# EasyEDA Pro project TPS7A系列低噪声电源.eprj

# Schematic Schematic1
Board Name: Board1; Create Date: 2023-06-15; Page Name: P1; Project Name: TPS7A系列低噪声电源; Schematic Name: Schematic1; Update Date: 2025-04-09; Company: 嘉立创EDA; Page Size: A3; Version: V1.0
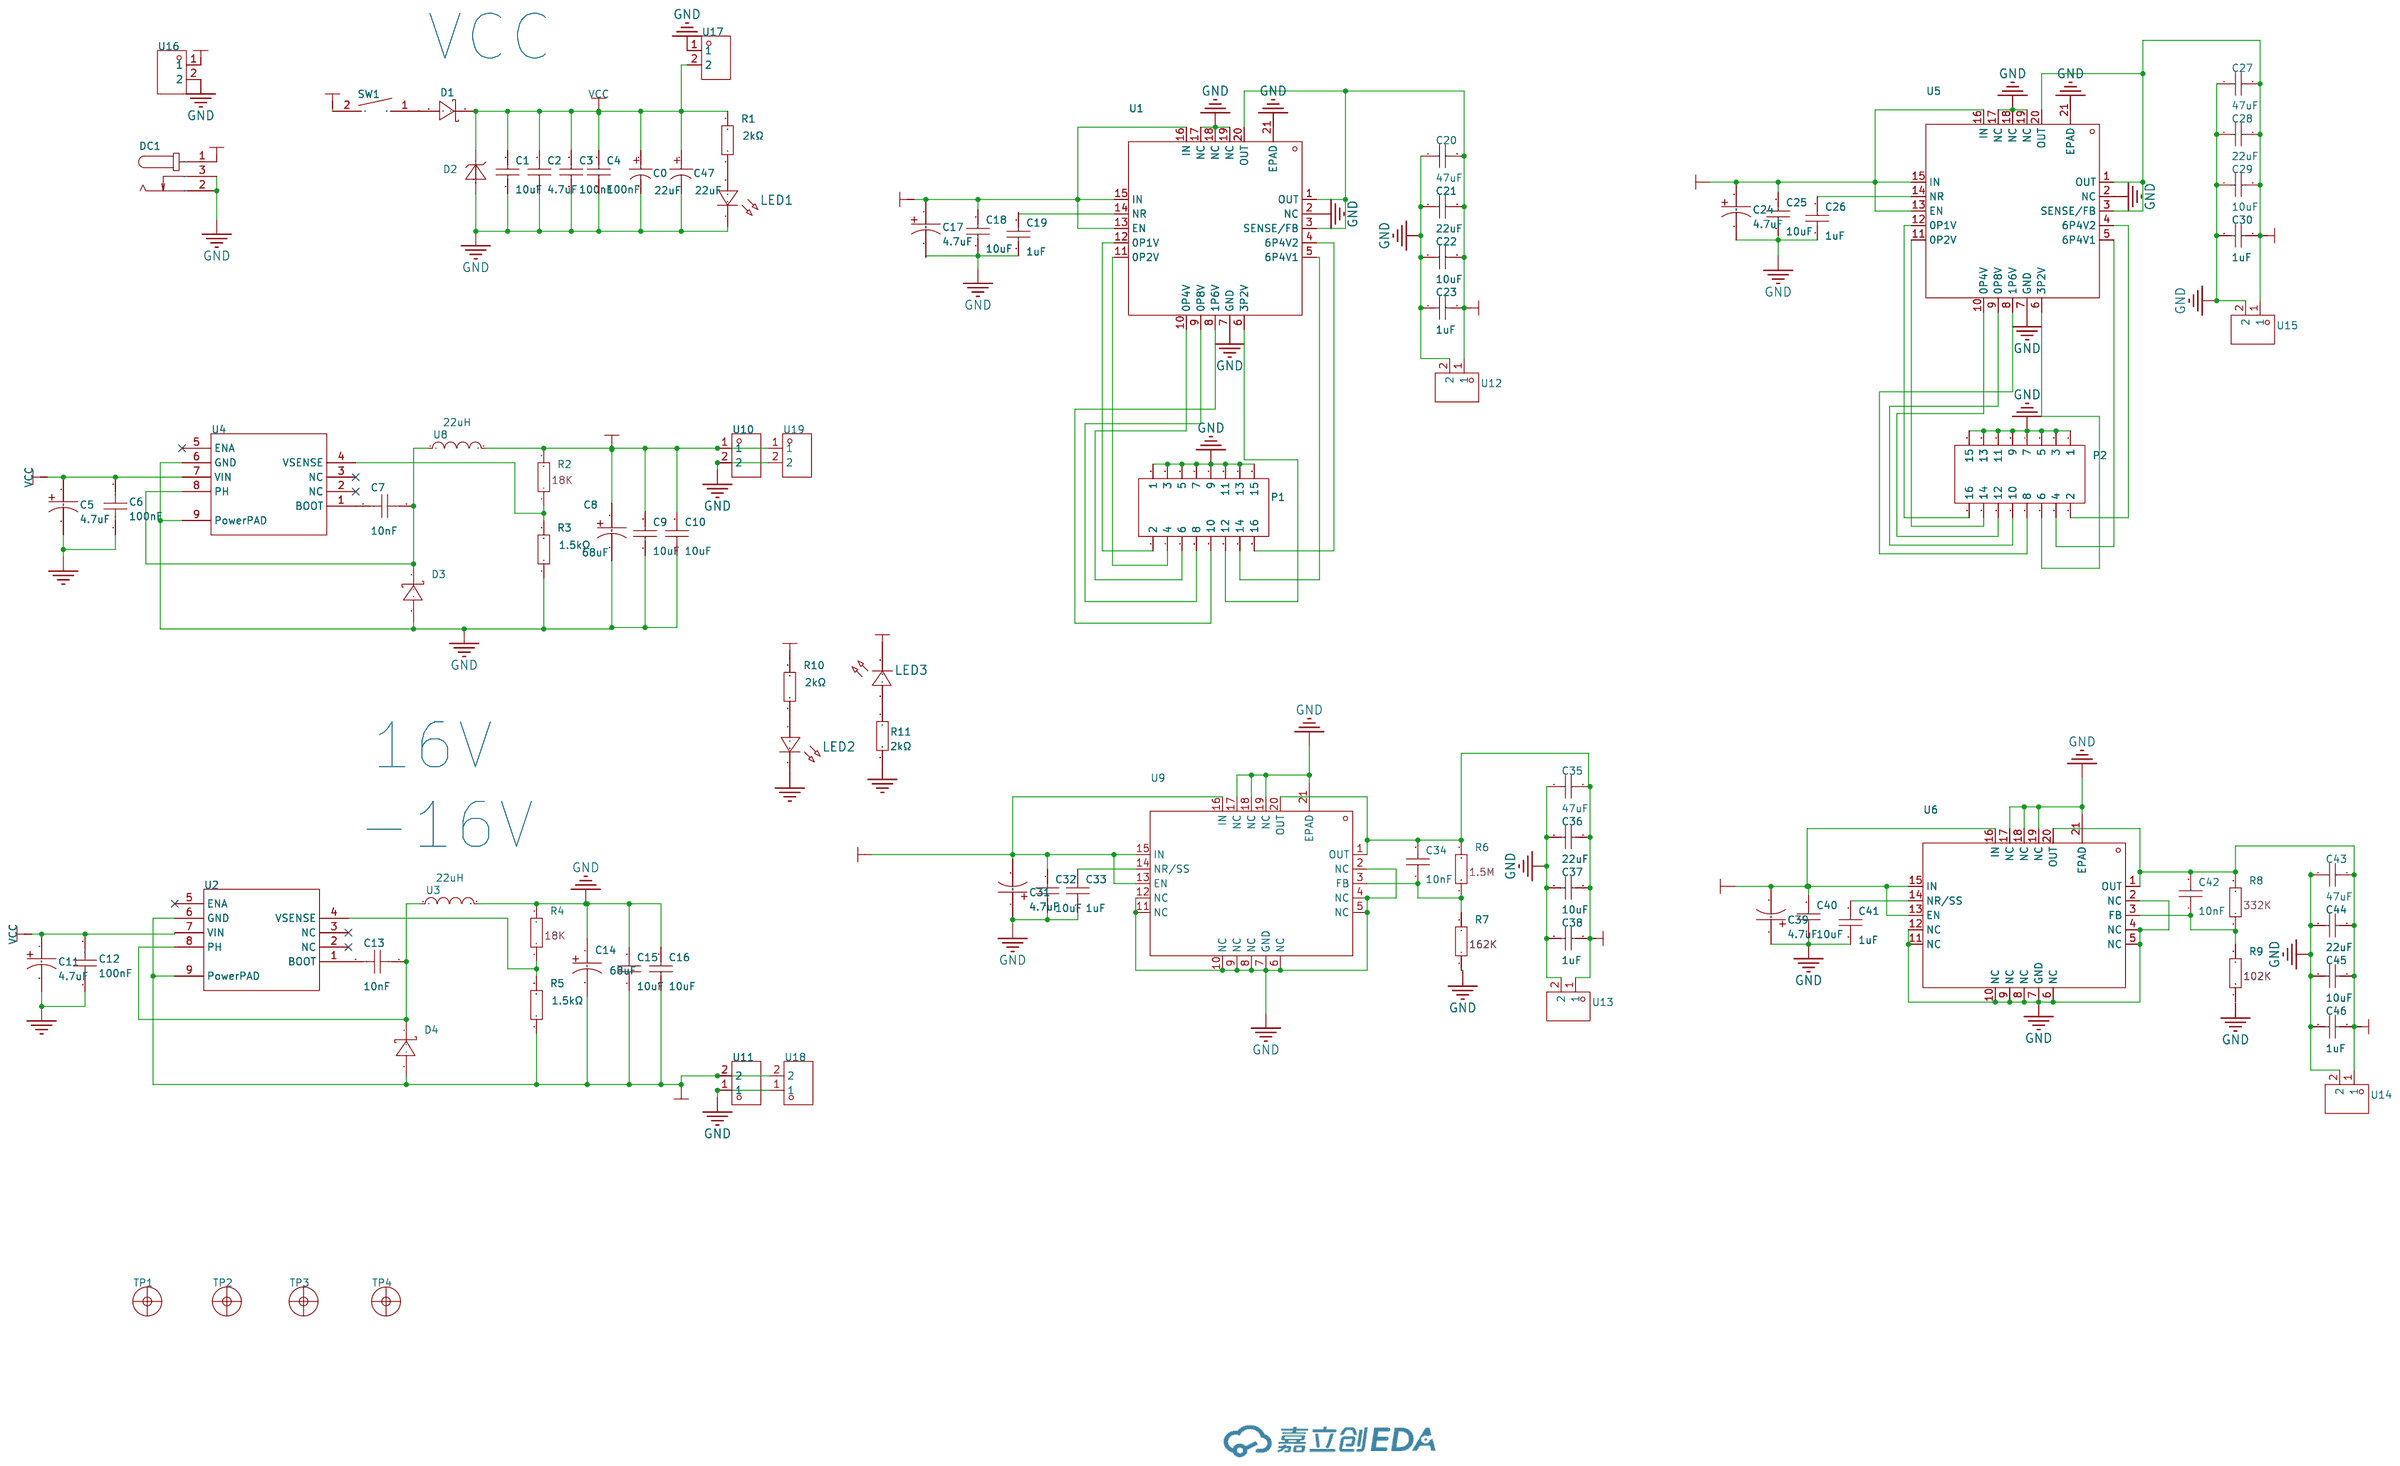
[diagram p0: schematic sheet]

## Parts
C0  22uF  [CAP-SMD_BD6.3-L6.6-W6.6-LS7.4-FD]
C1  10uF  [R0805]
C2  4.7uF  [R0805]
C3  100nF  [R0805]
C4  100nF  [R0805]
C5  4.7uF  [CAP-SMD_BD4.0-L4.3-W4.3-FD-A]
C6  100nF  [R0805]
C7  10nF  [R0805]
C8  68uF  [CAP-SMD_L7.3-W4.3]
C9  10uF  [R0805]
C10  10uF  [R0805]
C11  4.7uF  [CAP-SMD_BD4.0-L4.3-W4.3-FD-A]
C12  100nF  [R0805]
C13  10nF  [R0805]
C14  68uF  [CAP-SMD_L7.3-W4.3]
C15  10uF  [R0805]
C16  10uF  [R0805]
C17  4.7uF  [CAP-SMD_BD4.0-L4.3-W4.3-FD-A]
C18  10uF  [R0805]
C19  1uF  [R0805]
C20  47uF  [R0805]
C21  22uF  [R0805]
C22  10uF  [R0805]
C23  1uF  [R0805]
C24  4.7uF  [CAP-SMD_BD4.0-L4.3-W4.3-FD-A]
C25  10uF  [R0805]
C26  1uF  [R0805]
C27  47uF  [R0805]
C28  22uF  [R0805]
C29  10uF  [R0805]
C30  1uF  [R0805]
C31  4.7uF  [CAP-SMD_BD4.0-L4.3-W4.3-FD-A]
C32  10uF  [R0805]
C33  1uF  [R0805]
C34  10nF  [R0805]
C35  47uF  [R0805]
C36  22uF  [R0805]
C37  10uF  [R0805]
C38  1uF  [R0805]
C39  4.7uF  [CAP-SMD_BD4.0-L4.3-W4.3-FD-A]
C40  10uF  [R0805]
C41  1uF  [R0805]
C42  10nF  [R0805]
C43  47uF  [R0805]
C44  22uF  [R0805]
C45  10uF  [R0805]
C46  1uF  [R0805]
C47  22uF  [CAP-SMD_BD6.3-L6.6-W6.6-LS7.4-FD]
D1  B340A  [SMA_L4.3-W2.6-LS5.2-RD]
D2  SMBJ30A  [SMB_L4.4-W3.6-LS5.3-RD]
D3  B340A  [SMA_L4.3-W2.6-LS5.2-RD]
D4  B340A  [SMA_L4.3-W2.6-LS5.2-RD]
DC1  DC005  [DC-IN-TH_DC005]
LED1  -  [LED_0805]
LED2  -  [LED_0805]
LED3  -  [LED_0805]
P1  2.54-2*8P针  [HDR-TH_16P-P2.54-V-M-R2-C8-S2.54]
P2  2.54-2*8P针  [HDR-TH_16P-P2.54-V-M-R2-C8-S2.54]
R1  2kΩ  [R0805]
R2  0805W8F9101T5E  [R0805]
R3  1.5kΩ  [R0805]
R4  0805W8F9101T5E  [R0805]
R5  1.5kΩ  [R0805]
R6  0805W8F9101T5E  [R0805]
R7  0805W8F9101T5E  [R0805]
R8  0805W8F9101T5E  [R0805]
R9  0805W8F9101T5E  [R0805]
R10  2kΩ  [R0805]
R11  2kΩ  [R0805]
SW1  RS601HL-1010011BB  [SW-TH_RS601HL-1010011BB]
TP1  -  [M3]
TP2  -  [M3]
TP3  -  [M3]
TP4  -  [M3]
U1  TPS7A4701RGWR  [VQFN-20_L5.0-W5.0-P0.65-TL-EP]
U2  TPS5430DDAR  [SOIC-8_L5.0-W4.0-P1.27-LS6.0-BL-EP2.0]
U3  22uH  [IND-SMD_L7.0-W6.6]
U4  TPS5430DDAR  [SOIC-8_L5.0-W4.0-P1.27-LS6.0-BL-EP2.0]
U5  TPS7A4701RGWR  [VQFN-20_L5.0-W5.0-P0.65-TL-EP]
U6  TPS7A3301RGWR  [VQFN-20_L5.0-W5.0-P0.65-TL-EP]
U8  22uH  [IND-SMD_L7.0-W6.6]
U9  TPS7A3301RGWR  [VQFN-20_L5.0-W5.0-P0.65-TL-EP]
U10  KF301-5.0-2P  [CONN-TH_P5.00_KF301-5.0-2P]
U11  KF301-5.0-2P  [CONN-TH_P5.00_KF301-5.0-2P]
U12  KF301-5.0-2P  [CONN-TH_P5.00_KF301-5.0-2P]
U13  KF301-5.0-2P  [CONN-TH_P5.00_KF301-5.0-2P]
U14  KF301-5.0-2P  [CONN-TH_P5.00_KF301-5.0-2P]
U15  KF301-5.0-2P  [CONN-TH_P5.00_KF301-5.0-2P]
U16  KF301-5.0-2P  [CONN-TH_P5.00_KF301-5.0-2P]
U17  KF301-5.0-2P  [CONN-TH_P5.00_KF301-5.0-2P]
U18  KF301-5.0-2P  [CONN-TH_P5.00_KF301-5.0-2P]
U19  KF301-5.0-2P  [CONN-TH_P5.00_KF301-5.0-2P]

## Library data of the parts
C0 C47 = RT1J220M0607: 容值:22uF;精度:±20%;额定电压:63V;纹波电流:60mA@120Hz;等效串联电阻:-;; LCSC Part Name: 22uF ±20% 63V; Supplier Part: C267472; Manufacturer: ROQANG(容强); Supplier Footprint: SMD,D6.3xL7.7mm; JLCPCB Part Class: Extended Part; Datasheet: https://atta.szlcsc.com/upload/public/pdf/source/20180813/C267472_55C74989F74FEE2EA57202A0C1074BEF.pdf; Supplier: LCSC; Tolerance: ±20%; Rated Voltage: 63V; Ripple Current: 60mA@120Hz; φD: 6.3mm; L: 7.7mm; Lifetime @ Temp: 2000hrs@125℃; Operating Temperature: -40℃~+105℃
C1-C4 C9 C10 C15 C16 C18-C23 C25-C30 C32-C38 C40-C46 = 0805B104K500NT: 容值:100nF;精度:±10%;额定电压:50V;材质(温度系数):X7R;; LCSC Part Name: 100nF ±10% 50V; Supplier Part: C38141; Manufacturer: FH(风华); Supplier Footprint: 0805; JLCPCB Part Class: Extended Part; Datasheet: https://atta.szlcsc.com/upload/public/pdf/source/20170923/C38141_1506149447419988747.pdf; Supplier: LCSC; Tolerance: ±10%; Voltage Rated: 50V; Temperature Coefficient: X7R
C5 C11 C17 C24 C31 C39 = VT1H4R7M0405: 容值:4.7uF;精度:±20%;额定电压:50V;纹波电流:14mA@120Hz;等效串联电阻:-;; LCSC Part Name: 4.7uF ±20% 50V; Supplier Part: C213488; Manufacturer: ROQANG(容强); Supplier Footprint: SMD,D4xL5.4mm; JLCPCB Part Class: Extended Part; Datasheet: https://atta.szlcsc.com/upload/public/pdf/source/20180502/C191859_5B846418F1FC4C14CCCE0409874E2ED6.pdf; Supplier: LCSC; Tolerance: ±20%; Rated Voltage: 50V; Ripple Current: 14mA@120Hz; φD: 4mm; L: 5.4mm; Lifetime @ Temp: 2000hrs@105℃; Operating Temperature: -40℃~+105℃
C6 C12 = CAP_0805: Supplier Footprint: 0805
C7 C13 = CC0805KRX7R9BB103: 容值:10nF;精度:±10%;额定电压:50V;材质(温度系数):X7R;; LCSC Part Name: 10nF ±10% 50V; Supplier Part: C83170; Manufacturer: YAGEO(国巨); Supplier Footprint: 0805; JLCPCB Part Class: Extended Part; Datasheet: https://atta.szlcsc.com/upload/public/pdf/source/20160918/1474166948353.pdf; Supplier: LCSC; Tolerance: ±10%; Voltage Rated: 50V; Temperature Coefficient: X7R
C8 C14 = TPSE686K025R0125: 容值:68uF;精度:±10%;额定电压:25V;等效串联电阻:125mΩ@100kHz;工作温度:-55~+125;; LCSC Part Name: 68uF ±10% 25V; Supplier Part: C308898; Manufacturer: Kyocera AVX; Supplier Footprint: CASE-E-7343; JLCPCB Part Class: Extended Part; Datasheet: https://atta.szlcsc.com/upload/public/pdf/source/20190621/C308898_4799490B6172D2F0D5995569ED36D8B8.pdf; Supplier: LCSC; Tolerance: ±10%; Rated Voltage: 25V; Equivalent Series Resistance(ESR): 125mΩ@100kHz; Operating Temperature: -55~+125
D1 D3 D4 = B340A: 直流反向耐压(Vr):40V;平均整流电流(Io):3A;正向压降(Vf):550mV@3A;; LCSC Part Name: 40V 3A 550mV@3A; Supplier Part: C64982; Manufacturer: MDD; Supplier Footprint: SMA(DO-214AC); JLCPCB Part Class: Extended Part; Datasheet: https://atta.szlcsc.com/upload/public/pdf/source/20190305/C64982_253BE2A77E3EE8CB07EEC14FC38D9A1B.pdf; Supplier: LCSC; Reverse Voltage (Vr): 40V; Average Rectified Current (Io): 3A; Forward Voltage (Vf@If): 550mV@3A
D2 = SMBJ30A_C908803: 极性:单向;反向截止电压(Vrwm):30V;击穿电压:33.3V;反向漏电流(Ir):5uA;峰值脉冲电流(Ipp)@10/1000s:12.4A;最大钳位电压:48.4V;; LCSC Part Name: 单向 Vrwm:30V; Supplier Part: C908803; Manufacturer: GOODWORK(固得沃克); Supplier Footprint: SMB(DO-214AA); JLCPCB Part Class: Extended Part; Datasheet: https://atta.szlcsc.com/upload/public/pdf/source/20201231/C908783_5F0AE07776753216FC0A4122EEBBB8E2.pdf; Supplier: LCSC; Polarity: 单向; Reverse Stand-Off Voltage (Vrwm): 30V; Breakdown Voltage: 33.3V; Reverse Leakage Current (Ir): 5uA; Peak Pulse Current (Ipp)@10/1000μs: 12.4A; Maximum Clamping Voltage: 48.4V
DC1 = DC005: 连接器类型:DC电源插座;安装方式:弯插;触点内径:2mm;触点外径:6.3mm;额定电流:500mA;额定电压:30V;工作温度范围:-40~+55;; LCSC Part Name: DC电源插座 内径:2mm 外径:6.3mm 铁材质; Supplier Part: C431533; Manufacturer: SHOU HAN(首韩); Supplier Footprint: 插件; JLCPCB Part Class: Extended Part; Datasheet: https://atta.szlcsc.com/upload/public/pdf/source/20190925/C431533_4751811035784AC1D38EBC85F7905E99.pdf; Supplier: LCSC; Connector Type: DC电源插座; Mounting Style: 弯插; Inside Contact Diameter: 2mm; Outside Contact Diameter: 6.3mm; Current Rating (Max): 500mA; Voltage Rating (Max): 30V; Operating Temperature Range: -40~+55
LED1-LED3 = LED_0805-R: Supplier Footprint: 0805
P1 P2 = 2.54-2*8P针_C68234: 排数:双排;总PIN位数:16;间距:2.54mm;插针结构:2x8P;行距:2.54mm;安装类型:直插;圆针/方针:方针;额定电流:-;额定电压:-;配合针长度:5.9mm;塑高:2.54mm;端接针长度:-;触头材质:-;触头镀层:-;工作温度范围:-;焊接温度(最大值):-;颜色:黑色;; LCSC Part Name: 2.54mm 2x8P 直插 方针; Supplier Part: C68234; Manufacturer: BOOMELE(博穆精密); Supplier Footprint: 直插,P=2.54mm; JLCPCB Part Class: Extended Part; Datasheet: https://atta.szlcsc.com/upload/public/pdf/source/20221018/3E9408392E35E6F57A28985E5F7BF5C9.pdf; Supplier: LCSC; Number of Rows: 双排; Number of Pins: 16; Pitch: 2.54mm; Pin Structure: 2x8P; Row Spacing: 2.54mm; Mounting Type: 直插; Circluar Pins/Square Pins: 方针; Length of Mating Pin: 5.9mm; Insulation Height: 2.54mm; Color: 黑色
R1 R10 R11 = 0805W8F1002T5E_C17414: 电阻类型:厚膜电阻;阻值:10kΩ;精度:±1%;功率:125mW;温度系数:±100ppm/;最大工作电压:150V;工作温度范围:-55~+155;; LCSC Part Name: 10kΩ ±1% 125mW; Supplier Part: C17414; Manufacturer: UNI-ROYAL(厚声); Manufacturer Part: 0805W8F1002T5E; Supplier Footprint: 0805; JLCPCB Part Class: Basic Part; Datasheet: https://atta.szlcsc.com/upload/public/pdf/source/20200306/C422600_1E6D84923E4A46A82E41ADD87F860B5C.pdf; Supplier: LCSC; Type: 厚膜电阻; Tolerance: ±1%; Power(Watts): 125mW; Temperature Coefficient: ±100ppm/; Overload Voltage (Max): 150V; Operating Temperature Range: -55~+155
R2 R4 = 0805W8F9101T5E: 18K; LCSC Part Name: 9.1KΩ(9101) ±1% 编带; Supplier Part: C17855; Manufacturer: UNI-ROYAL(厚声); Supplier Footprint: 0805; JLCPCB Part Class: Basic Part; Datasheet: https://atta.szlcsc.com/upload/public/pdf/source/20170920/C17855_1505887278317980207.pdf; Supplier: LCSC
R3 R5 = 0805W8F3001T5E: 电阻类型:厚膜电阻;阻值:3kΩ;精度:±1%;功率:125mW;温度系数:±100ppm/;最大工作电压:150V;工作温度范围:-55~+155;; LCSC Part Name: 3kΩ ±1% 125mW; Supplier Part: C17661; Manufacturer: UNI-ROYAL(厚声); Supplier Footprint: 0805; JLCPCB Part Class: Basic Part; Datasheet: https://atta.szlcsc.com/upload/public/pdf/source/20200306/C422600_1E6D84923E4A46A82E41ADD87F860B5C.pdf; Supplier: LCSC; Type: 厚膜电阻; Tolerance: ±1%; Power(Watts): 125mW; Temperature Coefficient: ±100ppm/; Overload Voltage (Max): 150V; Operating Temperature Range: -55~+155
R6 = 0805W8F9101T5E: 1.5M; LCSC Part Name: 9.1KΩ(9101) ±1% 编带; Supplier Part: C17855; Manufacturer: UNI-ROYAL(厚声); Supplier Footprint: 0805; JLCPCB Part Class: Basic Part; Datasheet: https://atta.szlcsc.com/upload/public/pdf/source/20170920/C17855_1505887278317980207.pdf; Supplier: LCSC
R7 = 0805W8F9101T5E: 162K; LCSC Part Name: 9.1KΩ(9101) ±1% 编带; Supplier Part: C17855; Manufacturer: UNI-ROYAL(厚声); Supplier Footprint: 0805; JLCPCB Part Class: Basic Part; Datasheet: https://atta.szlcsc.com/upload/public/pdf/source/20170920/C17855_1505887278317980207.pdf; Supplier: LCSC
R8 = 0805W8F9101T5E: 332K; LCSC Part Name: 9.1KΩ(9101) ±1% 编带; Supplier Part: C17855; Manufacturer: UNI-ROYAL(厚声); Supplier Footprint: 0805; JLCPCB Part Class: Basic Part; Datasheet: https://atta.szlcsc.com/upload/public/pdf/source/20170920/C17855_1505887278317980207.pdf; Supplier: LCSC
R9 = 0805W8F9101T5E: 102K; LCSC Part Name: 9.1KΩ(9101) ±1% 编带; Supplier Part: C17855; Manufacturer: UNI-ROYAL(厚声); Supplier Footprint: 0805; JLCPCB Part Class: Basic Part; Datasheet: https://atta.szlcsc.com/upload/public/pdf/source/20170920/C17855_1505887278317980207.pdf; Supplier: LCSC
SW1 = RS601HL-1010011BB: 额定电流:3A;额定电压(AC):250V;额定电压(DC):-;电路结构:单刀单掷;机械寿命:10000;翘板形状:凹面弯曲;翘板颜色:黑色;翘板标志:| O;带灯:无;引脚样式:焊片;工作温度:-25~+85;开关长度:15mm;开关宽度:10.5mm;开关高度:11.7mm;; Supplier Part: C2885782; Manufacturer: HCTL(华灿天禄); Supplier Footprint: 插件; JLCPCB Part Class: Extended Part; Datasheet: https://atta.szlcsc.com/upload/public/pdf/source/20210820/B1970E40D09304D7FA648AE2099FB3E8.pdf; Supplier: LCSC; Contact Current: 3A; Voltage Rating (AC): 250V; Circuit: 单刀单掷; Mechanical Life: 10000; Actuator Type: 凹面弯曲; Actuator Color: 黑色; Actuator Marking: | O; With Lamp: 无; Pin Style: 焊片; Operating Temperature: -25~+85; Switch Length: 15mm; Switch Width: 10.5mm; Switch Height: 11.7mm
TP1-TP4 = 固定孔1: Supplier Part: C551322; JLCPCB Part Class: 扩展库
U1 U5 = TPS7A4701RGWR: 输出类型:可调;输出极性:正;最大输入电压:35V;输出电压:1.4V~34V;输出电流:1A;电源纹波抑制比(PSRR):78dB@(1kHz);; Supplier Part: C90084; Manufacturer: TI(德州仪器); Supplier Footprint: QFN-20-EP(5x5); JLCPCB Part Class: Extended Part; Datasheet: https://atta.szlcsc.com/upload/public/pdf/source/20180528/C90084_2B2777A840F611AF0E9616C4B6E1C04B.pdf; Supplier: LCSC; Output Type: 可调; Output Polarity: 正; Number of Outputs: 1; Maximum Input Voltage: 35V; Output Voltage: 1.4V~34V; Dropout Voltage: 450mV@(1A); Quiescent Current (Ground Current): 1mA; Output Current: 1A; Power Supply Rejection Ratio (PSRR): 78dB@(1kHz); Noise: 4.67uVrms; Feature: 过流保护；使能；过热保护
U2 U4 = TPS5430DDAR: 功能类型:降压型;同步整流:-;输出通道数:-;拓扑结构:-;输入电压:-;输出电流(最大值):-;开关频率:-;; LCSC Part Name: 降压型; Supplier Part: C9864; Manufacturer: TI(德州仪器); Supplier Footprint: SO-8; JLCPCB Part Class: Basic Part; Datasheet: https://atta.szlcsc.com/upload/public/pdf/source/20161207/1481104217724.pdf; Supplier: LCSC; Function: 降压型
U3 U8 = XR0650-6R8M: 电感值:6.8uH;精度:±20%;; LCSC Part Name: 6.8uH ±20%; Supplier Part: C5307647; Manufacturer: XR(祥如); Supplier Footprint: SMD,0650; JLCPCB Part Class: Extended Part; Datasheet: https://atta.szlcsc.com/upload/public/pdf/source/20221228/8F25018F537F239E81AF9D59F9CE91EF.pdf; Supplier: LCSC; Tolerance: ±20%
U6 U9 = TPS7A3301RGWR: 输出类型:可调;输出极性:负;最大输入电压:36V;输出电压:1.18V~33V;输出电流:1A;电源纹波抑制比(PSRR):72dB@(10kHz);; Supplier Part: C90082; Manufacturer: TI(德州仪器); Supplier Footprint: QFN-20-EP(5x5); JLCPCB Part Class: Extended Part; Datasheet: https://atta.szlcsc.com/upload/public/pdf/source/20180528/C90082_667F0DE537E66AC7CC07C54D0A96A461.pdf; Supplier: LCSC; Output Type: 可调; Output Polarity: 负; Number of Outputs: 1; Maximum Input Voltage: 36V; Output Voltage: 1.18V~33V; Dropout Voltage: 800mV@(1A); Output Current: 1A; Power Supply Rejection Ratio (PSRR): 72dB@(10kHz)
U10-U19 = KF301-5.0-2P: 结构:1x2P;间距:5mm;颜色:蓝色;安装方式:直插;额定电流:17A;额定电压:250V;排数:1;线规 - AWG:14~22;线规 - 平方毫米:1.5;每排PIN数:2;工作温度范围:-30℃~+120℃;; LCSC Part Name: 5mm 1x2P 排数:1 每排P数:2 直插; Supplier Part: C474881; Manufacturer: KEFA(科发); Supplier Footprint: 插件,P=5mm; JLCPCB Part Class: 扩展库; Datasheet: https://atta.szlcsc.com/upload/public/pdf/source/20230317/03A5B5FC229D6F9225E8F51DA1A4E80A.pdf; Supplier: LCSC; Structure: 1x2P; Pitch: 5mm; Color: 蓝色; Mounting Style: 直插; Current Rating (Max): 17A; Voltage Rating (Max): 250V; Number of Pins: 2P; Number of Rows: 1; Wire Gauge - AWG: 14~22; Wire Gauge - mm2: 1.5; Number of PINs Per Row: 2; Operating Temperature Range: -30℃~+120℃

## Nets
+16V: C8.1 C9.2 C10.2 C17.1 C18.2 C24.1 C25.2 R2.2 R10.2 U1.13(EN) U1.15(IN) U1.16(IN) U5.13(EN) U5.15(IN) U5.16(IN) U8.2 U10.1 U19.1
-16V: C14.2 C15.1 C16.1 C31.2 C32.2 C39.2 C40.2 D4.2(A) LED3.1(C) R5.1 U2.6(GND) U2.9(PowerPAD) U6.13(EN) U6.15(IN) U6.16(IN) U9.13(EN) U9.15(IN) U9.16(IN) U11.2 U18.2
GND: C0.2 C1.1 C2.1 C3.1 C4.1 C5.2 C6.1 C8.2 C9.1 C10.1 C11.2 C12.1 C14.1 C15.2 C16.2 C17.2 C18.1 C19.1 C20.1 C21.1 C22.1 C23.1 C24.2 C25.1 C26.1 C27.1 C28.1 C29.1 C30.1 C31.1 C32.1 C33.1 C35.1 C36.1 C37.1 C38.1 C39.1 C40.1 C41.1 C43.1 C44.1 C45.1 C46.1 C47.2 D2.2 D3.2(A) DC1.2 DC1.3 LED1.1(C) LED2.1(C) P1.1 P1.3 P1.5 P1.7 P1.9 P1.11 P1.13 P1.15 P2.1 P2.3 P2.5 P2.7 P2.9 P2.11 P2.13 P2.15 R3.1 R4.2 R7.1 R9.1 R11.2 U1.2(NC) U1.7(GND) U1.17(NC) U1.18(NC) U1.19(NC) U1.21(EPAD) U3.2 U4.6(GND) U4.9(PowerPAD) U5.2(NC) U5.7(GND) U5.17(NC) U5.18(NC) U5.19(NC) U5.21(EPAD) U6.2(NC) U6.4(NC) U6.5(NC) U6.6(NC) U6.7(GND) U6.8(NC) U6.9(NC) U6.10(NC) U6.11(NC) U6.12(NC) U6.17(NC) U6.18(NC) U6.19(NC) U6.21(EPAD) U9.2(NC) U9.4(NC) U9.5(NC) U9.6(NC) U9.7(GND) U9.8(NC) U9.9(NC) U9.10(NC) U9.11(NC) U9.12(NC) U9.17(NC) U9.18(NC) U9.19(NC) U9.21(EPAD) U10.2 U11.1 U12.2 U13.2 U14.2 U15.2 U16.2 U17.1 U18.1 U19.2
VCC: C0.1 C1.2 C2.2 C3.2 C4.2 C5.1 C6.2 C11.1 C12.2 C47.1 D1.1(K) D2.1 R1.2 U2.7(VIN) U4.7(VIN) U17.2
VIN: DC1.1 SW1.2 U16.1
OUT1+: C20.2 C21.2 C22.2 C23.2 U1.1(OUT) U1.3(SENSE/FB) U1.20(OUT) U12.1
OUT1-: C34.2 C35.2 C36.2 C37.2 C38.2 R6.2 U9.1(OUT) U9.20(OUT) U13.1
OUT2+: C27.2 C28.2 C29.2 C30.2 U5.1(OUT) U5.3(SENSE/FB) U5.20(OUT) U15.1
OUT2-: C42.2 C43.2 C44.2 C45.2 C46.2 R8.2 U6.1(OUT) U6.20(OUT) U14.1
$1N1673: C7.2 U4.1(BOOT)
$1N1674: C7.1 D3.1(K) U4.8(PH) U8.1
$1N1675: R2.1 R3.2 U4.4(VSENSE)
$1N1677: C13.2 U2.1(BOOT)
$1N1678: C13.1 D4.1(K) U2.8(PH) U3.1
$1N1679: R4.1 R5.2 U2.4(VSENSE)
$1N1681: D1.2(A) SW1.1
$1N1682: LED1.2(A) R1.1
$1N4208: C19.2 U1.14(NR)
$1N9903: C26.2 U5.14(NR)
$1N13903: C33.2 U9.14(NR/SS)
$1N21641: C34.1 R6.1 R7.2 U9.3(FB)
$1N23696: C41.2 U6.14(NR/SS)
$1N23700: C42.1 R8.1 R9.2 U6.3(FB)
$1N29330: P1.2 U1.12(0P1V)
$1N29599: P1.4 U1.11(0P2V)
$1N29869: P1.6 U1.10(0P4V)
$1N30141: P1.8 U1.9(0P8V)
$1N30413: P1.10 U1.8(1P6V)
$1N30680: P1.12 U1.6(3P2V)
$1N30951: P1.14 U1.5(6P4V1)
$1N32555: P2.16 U5.12(0P1V)
$1N32824: P2.14 U5.11(0P2V)
$1N33094: P2.12 U5.10(0P4V)
$1N33366: P2.10 U5.9(0P8V)
$1N33638: P2.8 U5.8(1P6V)
$1N33905: P2.6 U5.6(3P2V)
$1N34176: P2.4 U5.5(6P4V1)
$1N34444: P2.2 U5.4(6P4V2)
$1N39386: P1.16 U1.4(6P4V2)
$1N51388: LED2.2(A) R10.1
$1N51483: LED3.2(A) R11.1

Not connected (* = marked no-connect by the designer): U2 2(NC)* 3(NC)* 5(ENA)*; U4 2(NC)* 3(NC)* 5(ENA)*

## Notes on the sheet
- VCC
- 16V
- -16V

# Board PCB1
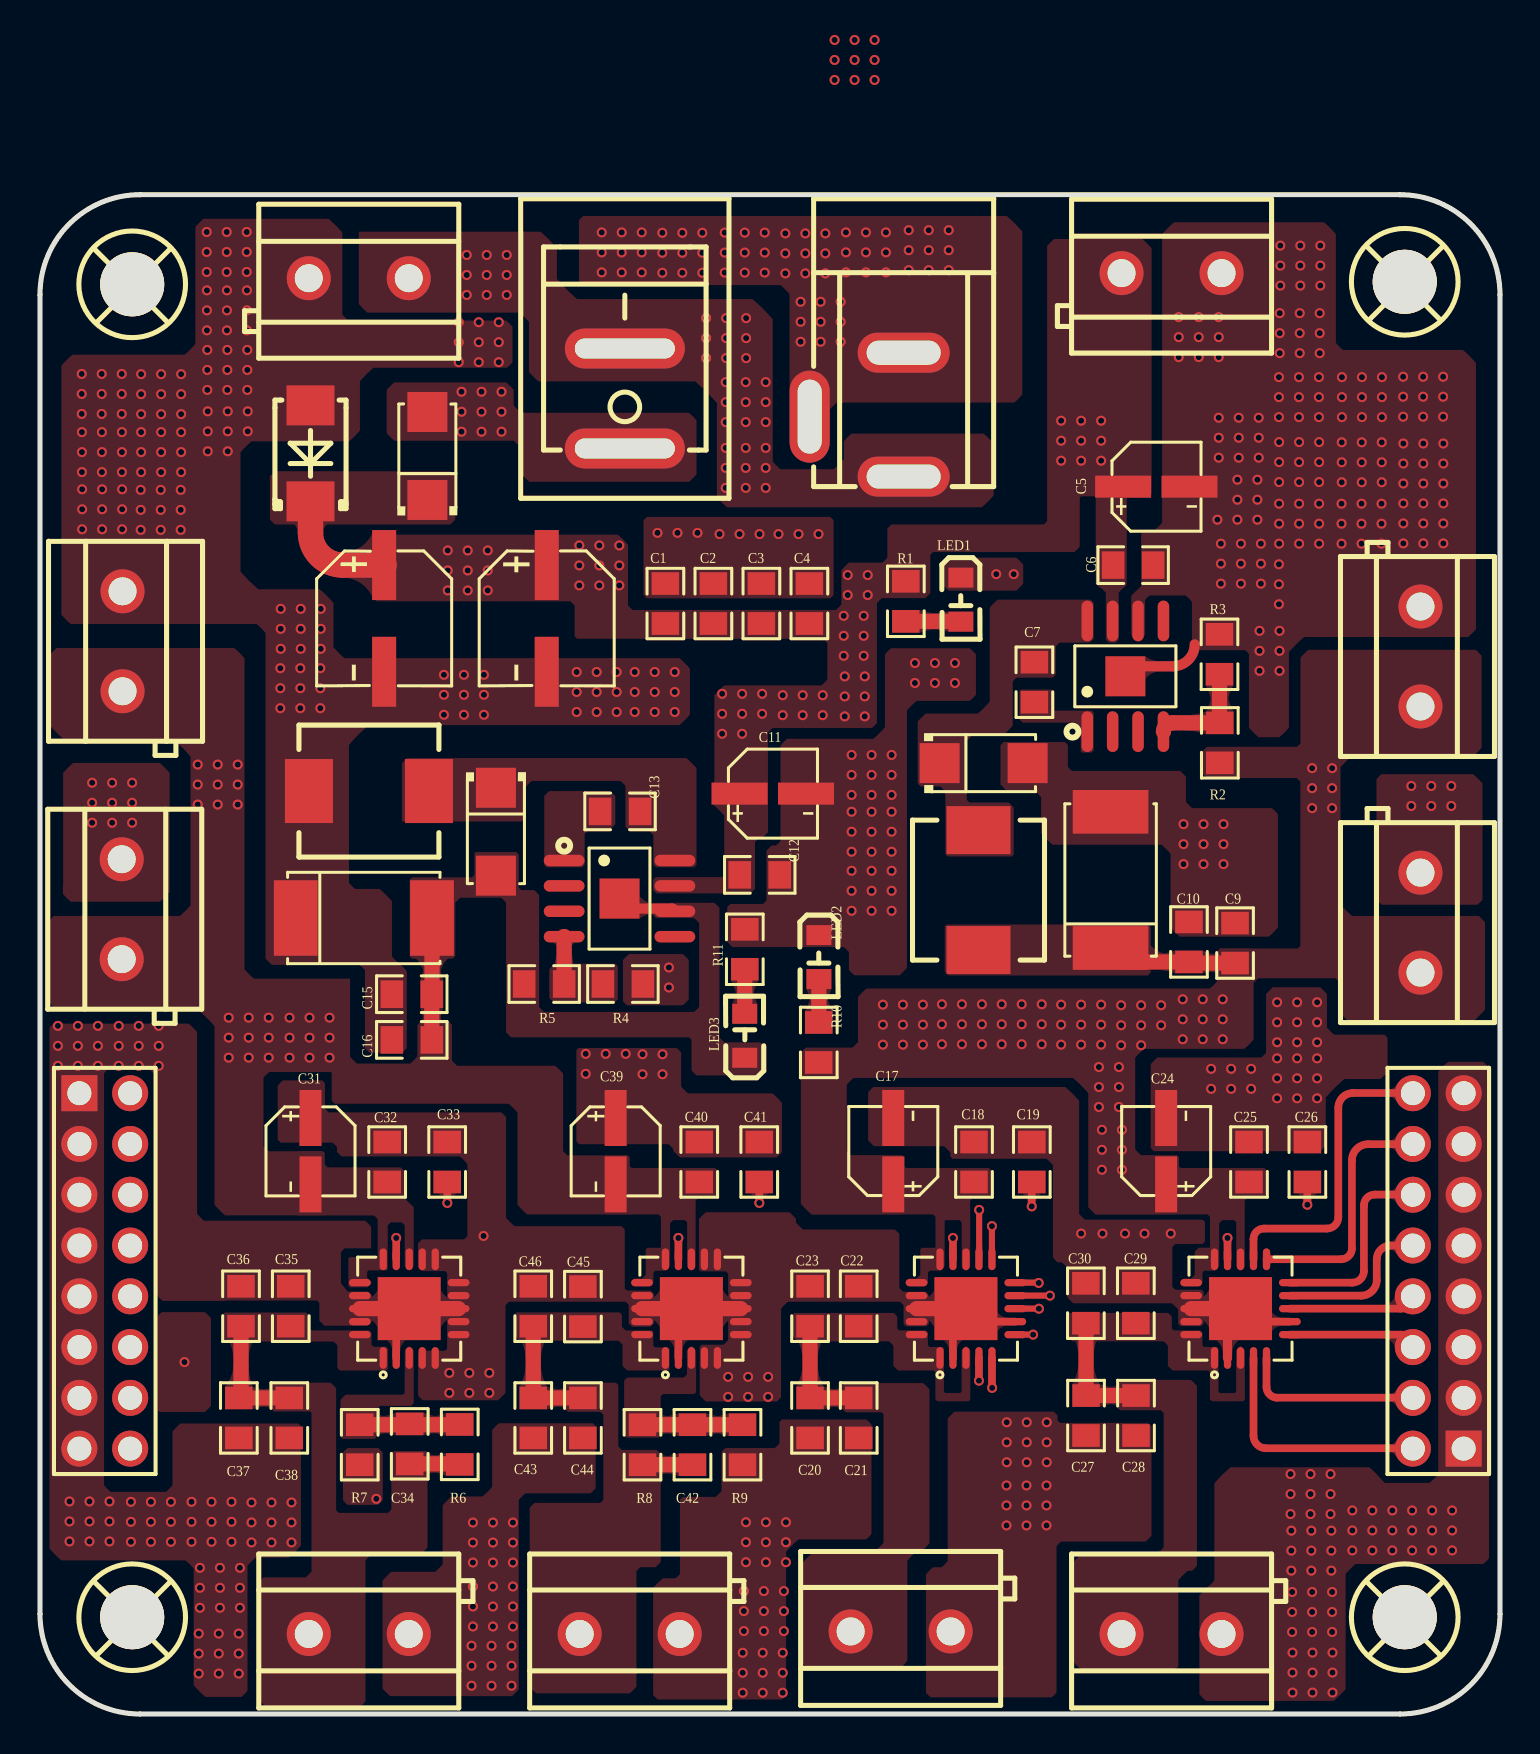
[diagram p1: board, top side]
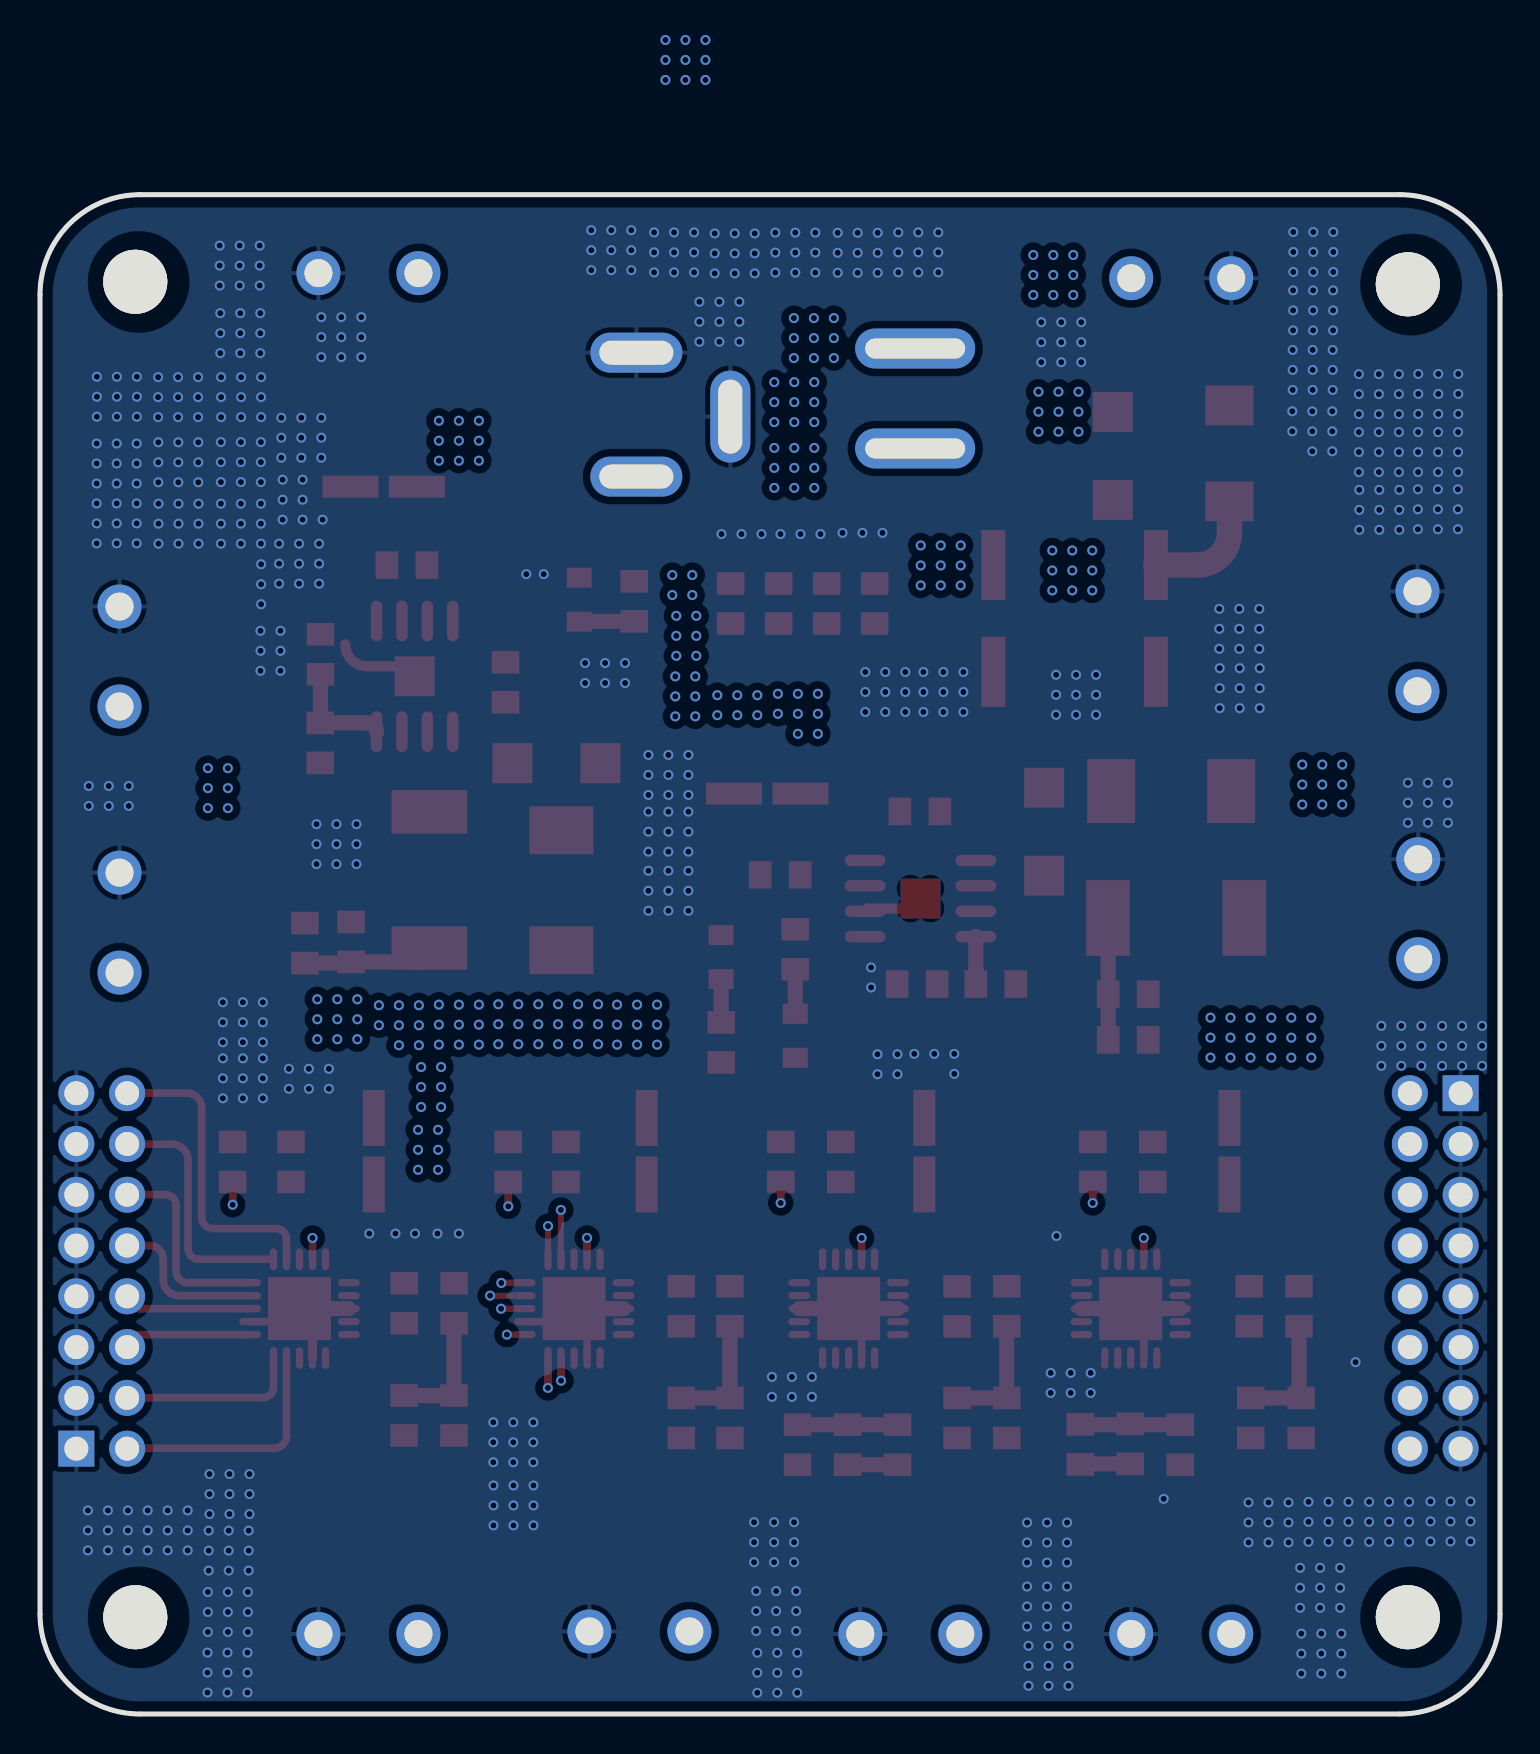
[diagram p2: board, bottom side, seen from below]

Outline 73 x 76 mm; copper layers: Top Layer, Inner1, Inner2, Bottom Layer. Coordinates in mm from the lower left corner of the outline.
Outline path: 0,71 0,5 arc(1.46,1.46) 5,0 68,0 arc(71.54,1.46) 73,5 73,71 arc(71.54,74.54) 68,76 5,76 arc(1.46,74.54) 0,71
Stack: Top Layer 0.035mm 外层铜厚1oz / Dielectric1 0.2104mm 7628 RC49% 8.6mil / Inner1 0.0152mm 内层铜厚 / Dielectric2 1.065mm 1.1mm H/HOZ Copper / Inner2 0.0152mm 内层铜厚 / Dielectric3 0.2104mm 7628 RC49% 8.6mil / Bottom Layer 0.035mm 外层铜厚1oz

## Design rules (mm)
spacing safeClearance (default): track to track 0.152, other pairs 0.152 to 0.3
track width trackWidth (default): min 0.127, default 0.254, max 2.54
differential pair differentialPair (default): width min 0.127, default 0.254, max 2.54; gap min 0.152, default 0.152
via viaSize (default): diameter min 0.5, default 0.61, max 10; hole min 0.3, default 0.305, max 6

## Placement (name value [footprint] x y rotation side)
C0  22uF  [CAP-SMD_BD6.3-L6.6-W6.6-LS7.4-FD]  25.34 54.8 270 top
C1  10uF  [R0805]  31.27 55.44 270 top
C2  4.7uF  [R0805]  33.67 55.44 270 top
C3  100nF  [R0805]  36.07 55.44 270 top
C4  100nF  [R0805]  38.47 55.44 270 top
C5  4.7uF  [CAP-SMD_BD4.0-L4.3-W4.3-FD-A]  55.82 61.39 0 top
C6  100nF  [R0805]  54.55 57.47 180 top
C7  10nF  [R0805]  49.72 51.5 270 top
C8  68uF  [CAP-SMD_L7.3-W4.3]  53.53 41.72 270 top
C9  10uF  [R0805]  59.75 38.45 270 top
C10  10uF  [R0805]  57.45 38.51 270 top
C11  4.7uF  [CAP-SMD_BD4.0-L4.3-W4.3-FD-A]  36.64 46.04 0 top
C12  100nF  [R0805]  35.88 41.98 180 top
C13  10nF  [R0805]  28.89 45.15 180 top
C14  68uF  [CAP-SMD_L7.3-W4.3]  16.19 39.82 180 top
C15  10uF  [R0805]  18.48 36.01 180 top
C16  10uF  [R0805]  18.48 33.72 180 top
C17  4.7uF  [CAP-SMD_BD4.0-L4.3-W4.3-FD-A]  42.66 28.15 90 top
C18  10uF  [R0805]  46.7 27.5 270 top
C19  1uF  [R0805]  49.59 27.5 270 top
C20  47uF  [R0805]  38.5 14.92 90 top
C21  22uF  [R0805]  40.94 14.92 90 top
C22  10uF  [R0805]  40.94 20.29 270 top
C23  1uF  [R0805]  38.5 20.29 270 top
C24  4.7uF  [CAP-SMD_BD4.0-L4.3-W4.3-FD-A]  56.31 28.15 90 top
C25  10uF  [R0805]  60.45 27.5 270 top
C26  1uF  [R0805]  63.37 27.5 270 top
C27  47uF  [R0805]  52.3 15.04 90 top
C28  22uF  [R0805]  54.8 15.04 90 top
C29  10uF  [R0805]  54.79 20.44 270 top
C30  1uF  [R0805]  52.29 20.44 270 top
C31  4.7uF  [CAP-SMD_BD4.0-L4.3-W4.3-FD-A]  13.53 28.15 270 top
C32  10uF  [R0805]  17.36 27.5 270 top
C33  1uF  [R0805]  20.36 27.5 270 top
C34  10nF  [R0805]  18.49 13.4 270 top
C35  47uF  [R0805]  12.54 20.29 270 top
C36  22uF  [R0805]  10.05 20.29 270 top
C37  10uF  [R0805]  9.94 14.92 90 top
C38  1uF  [R0805]  12.46 14.92 90 top
C39  4.7uF  [CAP-SMD_BD4.0-L4.3-W4.3-FD-A]  28.78 28.15 270 top
C40  10uF  [R0805]  32.96 27.5 270 top
C41  1uF  [R0805]  35.96 27.5 270 top
C42  10nF  [R0805]  32.62 13.36 270 top
C43  47uF  [R0805]  24.66 14.92 90 top
C44  22uF  [R0805]  27.15 14.92 90 top
C45  10uF  [R0805]  27.15 20.27 270 top
C46  1uF  [R0805]  24.66 20.29 270 top
C47  22uF  [CAP-SMD_BD6.3-L6.6-W6.6-LS7.4-FD]  17.21 54.8 270 top
D1  B340A  [SMA_L4.3-W2.6-LS5.2-RD]  19.37 62.93 90 top
D2  SMBJ30A  [SMB_L4.4-W3.6-LS5.3-RD]  13.53 63.06 90 top
D3  B340A  [SMA_L4.3-W2.6-LS5.2-RD]  47.18 47.56 0 top
D4  B340A  [SMA_L4.3-W2.6-LS5.2-RD]  22.8 44.14 270 top
DC1  DC005  [DC-IN-TH_DC005]  40.83 65 270 top
LED1  -  [LED_0805]  46.04 55.69 270 top
LED2  -  [LED_0805]  38.94 37.81 270 top
LED3  -  [LED_0805]  35.24 33.98 90 top
P1  2.54-2*8P针  [HDR-TH_16P-P2.54-V-M-R2-C8-S2.54]  3.24 22.16 270 top
P2  2.54-2*8P针  [HDR-TH_16P-P2.54-V-M-R2-C8-S2.54]  69.91 22.16 90 top
R1  2kΩ  [R0805#2]  43.29 55.66 90 top
R2  0805W8F9101T5E  [R0805#2]  58.99 48.58 270 top
R3  1.5kΩ  [R0805#2]  58.98 53.01 270 top
R4  0805W8F9101T5E  [R0805#2]  29.15 36.52 0 top
R5  1.5kΩ  [R0805#2]  25.21 36.52 0 top
R6  0805W8F9101T5E  [R0805#2]  20.99 13.49 270 top
R7  0805W8F9101T5E  [R0805#2]  15.99 13.47 90 top
R8  0805W8F9101T5E  [R0805#2]  30.12 13.47 270 top
R9  0805W8F9101T5E  [R0805#2]  35.12 13.47 90 top
R10  2kΩ  [R0805#2]  38.94 33.59 270 top
R11  2kΩ  [R0805#2]  35.24 38.25 90 top
SW1  RS601HL-1010011BB  [SW-TH_RS601HL-1010011BB]  29.24 65.81 90 top
TP1  -  [M3]  4.44 71.5 0 top
TP2  -  [M3]  68.07 71.63 0 top
TP3  -  [M3]  4.44 4.83 0 top
TP4  -  [M3]  68.07 4.83 0 top
U1  TPS7A4701RGWR  [VQFN-20_L5.0-W5.0-P0.65-TL-EP]  46.3 20.28 90 top
U2  TPS5430DDAR  [SOIC-8_L5.0-W4.0-P1.27-LS6.0-BL-EP2.0]  28.98 40.79 270 top
U3  22uH  [IND-SMD_L7.0-W6.6]  16.45 46.17 180 top
U4  TPS5430DDAR  [SOIC-8_L5.0-W4.0-P1.27-LS6.0-BL-EP2.0]  54.27 51.91 0 top
U5  TPS7A4701RGWR  [VQFN-20_L5.0-W5.0-P0.65-TL-EP]  60.03 20.28 90 top
U6  TPS7A3301RGWR  [VQFN-20_L5.0-W5.0-P0.65-TL-EP]  32.57 20.28 90 top
U8  22uH  [IND-SMD_L7.0-W6.6]  46.93 41.21 270 top
U9  TPS7A3301RGWR  [VQFN-20_L5.0-W5.0-P0.65-TL-EP]  18.46 20.28 90 top
U10  KF301-5.0-2P  [CONN-TH_P5.00_KF301-5.0-2P]  69.02 52.9 90 top
U11  KF301-5.0-2P  [CONN-TH_P5.00_KF301-5.0-2P]  4.13 53.66 270 top
U12  KF301-5.0-2P  [CONN-TH_P5.00_KF301-5.0-2P]  43.03 4.13 0 top
U13  KF301-5.0-2P  [CONN-TH_P5.00_KF301-5.0-2P]  15.94 4 0 top
U14  KF301-5.0-2P  [CONN-TH_P5.00_KF301-5.0-2P]  29.48 4 0 top
U15  KF301-5.0-2P  [CONN-TH_P5.00_KF301-5.0-2P]  56.58 4 0 top
U16  KF301-5.0-2P  [CONN-TH_P5.00_KF301-5.0-2P]  15.94 71.82 180 top
U17  KF301-5.0-2P  [CONN-TH_P5.00_KF301-5.0-2P]  56.58 72.08 180 top
U18  KF301-5.0-2P  [CONN-TH_P5.00_KF301-5.0-2P]  4.09 40.26 270 top
U19  KF301-5.0-2P  [CONN-TH_P5.00_KF301-5.0-2P]  69.02 39.59 90 top

## Footprints (pads in the part's own frame, mm; a bottom-side part is the same pattern mirrored in y, then rotated)
CAP-SMD_BD4.0-L4.3-W4.3-FD-A
  rect 2.8x1.1 smd: 1(-1.661,0) 2(1.661,0)
CAP-SMD_BD6.3-L6.6-W6.6-LS7.4-FD
  rect 3.5x1.2 smd: 1(-2.67,0) 2(2.67,0)
CAP-SMD_L7.3-W4.3
  rect 2.185x3.78 smd: 1(3.406,0) 2(-3.406,0)
CONN-TH_P5.00_KF301-5.0-2P
  round 2.2 hole 1.4: 1(-2.5,0) 2(2.5,0)
DC-IN-TH_DC005
  oval 2x4.6 hole 1.2x3.7: 1(3.1,2.35) 2(-3.1,2.35)
  oval 4.6x2 hole 3.7x1.2: 3(0.1,-2.35)
HDR-TH_16P-P2.54-V-M-R2-C8-S2.54
  rect 1.8x1.8 hole 1.2: 1(-8.89,-1.27)
  round 1.8 hole 1.2: 2(-8.89,1.27) 3(-6.35,-1.27) 4(-6.35,1.27) 5(-3.81,-1.27) 6(-3.81,1.27) 7(-1.27,-1.27) 8(-1.27,1.27) 9(1.27,-1.27) 10(1.27,1.27) 11(3.81,-1.27) 12(3.81,1.27) 13(6.35,-1.27) 14(6.35,1.27) 15(8.89,-1.27) 16(8.89,1.27)
IND-SMD_L7.0-W6.6
  rect 2.4x3.2 smd: 1(-3,0) 2(3,0)
LED_0805
  rect 1x1.25 smd: 1(-1.15,0.005) 2(1.05,0.005)
M3
  round 3.2 hole 3.2: 1(0.165,0.013)
R0805
  rect 1.133x1.377 smd: 1(-1.111,0) 2(0.889,0)
R0805#2
  rect 1.133x1.377 smd: 1(-1,0) 2(1,0)
SMA_L4.3-W2.6-LS5.2-RD
  rect 2x2 smd: 1(-2.2,0) 2(2.2,0)
SMB_L4.4-W3.6-LS5.3-RD
  rect 1.999x2.401 smd: 1(-2.401,0) 2(2.401,0)
SOIC-8_L5.0-W4.0-P1.27-LS6.0-BL-EP2.0
  oval 0.574x2.037 smd: 1(-1.905,-2.768) 2(-0.635,-2.768) 3(0.635,-2.768) 4(1.905,-2.768) 5(1.905,2.768) 6(0.635,2.768) 7(-0.635,2.768) 8(-1.905,2.768)
  rect 1.999x1.999 smd: 9(0,0)
SW-TH_RS601HL-1010011BB
  oval 2x6 hole 1x5: 1(-2.5,0) 2(2.5,0)
VQFN-20_L5.0-W5.0-P0.65-TL-EP
  oval 1.087x0.364 smd: 1(-2.469,1.3) 2(-2.469,0.65) 3(-2.469,0) 4(-2.469,-0.65) 5(-2.469,-1.3) 11(2.469,-1.3) 12(2.469,-0.65) 13(2.469,0) 14(2.469,0.65) 15(2.469,1.3)
  oval 0.364x1.087 smd: 6(-1.3,-2.469) 7(-0.65,-2.469) 8(0,-2.469) 9(0.65,-2.469) 10(1.3,-2.469) 16(1.3,2.469) 17(0.65,2.469) 18(0,2.469) 19(-0.65,2.469) 20(-1.3,2.469)
  rect 3.15x3.15 smd: 21(0,0)

## Nets
As in the schematic.

Pads without a net: TP1 1; TP2 1; TP3 1; TP4 1; U2 2 3 5; U4 2 3 5

## Via types
v1: diameter 0.5, hole 0.305, Top Layer to Bottom Layer, 893 vias

## Routing (per net, layer and track width the routed paths; a pad name or vN(x,y) marks a point on that pad's centre or on a via; arc(x,y) is an arc through that point)
+16V: length 6.7
  Top Layer w0.762: C9.2 57.5,37.56 arc(57.46,37.58) C10.2 54.23,37.62 arc(53.73,37.82) 53.53,38.32
  vias: v1(42.15,35.48) v1(42.15,34.48) v1(42.15,33.48) v1(43.15,35.48) v1(43.15,34.48) v1(43.15,33.48) v1(44.15,35.48) v1(44.15,34.48) v1(44.15,33.48) v1(45.1,35.5) v1(45.1,34.5) v1(45.1,33.5) v1(46.1,35.5) v1(46.1,34.5) v1(46.1,33.5) v1(47.1,35.5) v1(47.1,34.5) v1(47.1,33.5) v1(48.09,35.5) v1(48.09,34.5) v1(48.09,33.5) v1(49.09,35.5) v1(49.09,34.5) v1(49.09,33.5) v1(50.09,35.5) v1(50.09,34.5) v1(50.09,33.5) v1(51.06,35.48) v1(51.06,34.48) v1(51.06,33.48) v1(52.06,35.48) v1(52.06,34.48) v1(52.06,33.48) v1(52.95,32.36) v1(52.95,31.36) v1(52.95,30.36) v1(53.06,35.48) v1(53.06,34.48) v1(53.06,33.48) v1(53.1,29.22) v1(53.1,28.22) v1(53.1,27.22) v1(53.95,32.36) v1(53.95,31.36) v1(53.95,30.36) v1(54.06,35.45) v1(54.06,34.45) v1(54.06,33.45) v1(54.1,29.22) v1(54.1,28.22) v1(54.1,27.22) v1(55.06,35.45) v1(55.06,34.45) v1(55.06,33.45) v1(56.06,35.45) v1(56.06,34.45) v1(57.14,35.75) v1(57.14,34.75) v1(57.14,33.75) v1(58.14,35.75) v1(58.14,34.75) v1(58.14,33.75) v1(59.14,35.75) v1(59.14,34.75) v1(59.14,33.75) v1(63.61,47.31) v1(63.61,46.31) v1(63.61,45.31) v1(64.61,47.31) v1(64.61,46.31) v1(64.61,45.31)
-16V: length 8.4
  Top Layer w0.508: 29.48,40.29 31.61,40.29 arc(31.71,40.25) U2.6
  Top Layer w0.762: C16.1 C15.1 arc(19.6,36.01) 19.6,36.02 C14.2
  vias: v1(7.89,47.49) v1(7.89,46.49) v1(7.89,45.49) v1(8.89,47.49) v1(8.89,46.49) v1(8.89,45.49) v1(9.44,34.83) v1(9.44,33.83) v1(9.44,32.83) v1(9.89,47.49) v1(9.89,46.49) v1(9.89,45.49) v1(10.44,34.83) v1(10.44,33.83) v1(10.44,32.83) v1(11.44,34.83) v1(11.44,33.83) v1(11.44,32.83) v1(12.48,34.83) v1(12.48,33.83) v1(12.48,32.83) v1(13.48,34.83) v1(13.48,33.83) v1(13.48,32.83) v1(14.48,34.83) v1(14.48,33.83) v1(14.48,32.83)
GND: length 35.4
  Top Layer w0.381: U1.7 46.95,19.63 arc(46.49,19.82) U1.21 arc(45.84,20.09) 45.65,19.63 U1.2 ; U6.2 31.92,19.63 arc(32.11,20.09) U6.21 ; U9.2 17.81,19.63 arc(18,20.09) 18.46,20.28 ; U5.7 60.68,19.63 arc(60.22,19.82) 60.03,20.28
  Top Layer w0.457: U5.2 59.38,19.63 arc(59.57,20.09) 60.03,20.28
  Top Layer w0.508: 54.77,52.41 56.64,52.41 arc(57.42,52.73) 57.74,53.5
  Top Layer w0.762: U6.8 U6.21 U6.18 ; 60.03,20.28 U5.18 ; U1.21 U1.18 ; U9.8 U9.18
  vias: v1(0.9,34.42) v1(0.9,33.42) v1(0.9,32.42) v1(1.48,10.63) v1(1.48,9.63) v1(1.48,8.63) v1(1.9,34.42) v1(1.9,33.42) v1(1.9,32.42) v1(2.09,67.03) v1(2.09,66.03) v1(2.09,65.03) v1(2.1,64.12) v1(2.1,63.12) v1(2.1,62.12) v1(2.11,61.26) v1(2.11,60.26) v1(2.11,59.26) v1(2.48,10.63) v1(2.48,9.63) v1(2.48,8.63) v1(2.61,46.58) v1(2.61,45.58) v1(2.61,44.58) v1(2.9,34.42) v1(2.9,33.42) v1(2.9,32.42) v1(3.09,67.03) v1(3.09,66.03) v1(3.09,65.03) v1(3.1,64.12) v1(3.1,63.12) v1(3.1,62.12) v1(3.11,61.26) v1(3.11,60.26) v1(3.11,59.26) v1(3.48,10.63) v1(3.48,9.63) v1(3.48,8.63) v1(3.61,46.58) v1(3.61,45.58) v1(3.61,44.58) v1(3.94,34.42) v1(3.94,33.42) v1(3.94,32.42) v1(4.09,67.03) v1(4.09,66.03) v1(4.09,65.03) v1(4.1,64.12) v1(4.1,63.12) v1(4.1,62.12) v1(4.11,61.26) v1(4.11,60.26) v1(4.11,59.26) v1(4.55,10.61) v1(4.55,9.61) v1(4.55,8.61) v1(4.61,46.58) v1(4.61,45.58) v1(4.61,44.58) v1(4.94,34.42) v1(4.94,33.42) v1(4.94,32.42) v1(5.06,67.02) v1(5.06,66.02) v1(5.06,65.02) v1(5.06,64.12) v1(5.06,63.12) v1(5.06,62.12) v1(5.04,61.23) v1(5.04,60.23) v1(5.04,59.23) v1(5.55,10.61) v1(5.55,9.61) v1(5.55,8.61) v1(5.94,34.42) v1(5.94,33.42) v1(5.94,32.42) v1(6.06,67.02) v1(6.06,66.02) v1(6.06,65.02) v1(6.06,64.12) v1(6.06,63.12) v1(6.06,62.12) v1(6.04,61.23) v1(6.04,60.23) v1(6.04,59.23) v1(6.55,10.61) v1(6.55,9.61) v1(6.55,8.61) v1(7.06,67.02) v1(7.06,66.02) v1(7.06,65.02) v1(7.06,64.12) v1(7.06,63.12) v1(7.06,62.12) v1(7.04,61.23) v1(7.04,60.23) v1(7.04,59.23) v1(7.22,17.6) v1(7.58,10.61) v1(7.58,9.61) v1(7.58,8.61) v1(7.94,4.02) v1(7.94,3.02) v1(7.94,2.02) v1(8,7.31) v1(8,6.31) v1(8,5.31) v1(8.34,74.13) v1(8.34,73.13) v1(8.34,72.13) v1(8.35,71.21) v1(8.35,70.21) v1(8.35,69.21) v1(8.37,68.23) v1(8.37,67.23) v1(8.37,66.23) v1(8.39,65.16) v1(8.39,64.16) v1(8.39,63.16) v1(8.58,10.61) v1(8.58,9.61) v1(8.58,8.61) v1(8.94,4.02) v1(8.94,3.02) v1(8.94,2.02) v1(9,7.31) v1(9,6.31) v1(9,5.31) v1(9.34,74.13) v1(9.34,73.13) v1(9.34,72.13) v1(9.35,71.21) v1(9.35,70.21) v1(9.35,69.21) v1(9.37,68.23) v1(9.37,67.23) v1(9.37,66.23) v1(9.39,65.16) v1(9.39,64.16) v1(9.39,63.16) v1(9.58,10.61) v1(9.58,9.61) v1(9.58,8.61) v1(9.94,4.02) v1(9.94,3.02) v1(9.94,2.02) v1(10,7.31) v1(10,6.31) v1(10,5.31) v1(10.34,74.13) v1(10.34,73.13) v1(10.34,72.13) v1(10.35,71.21) v1(10.35,70.21) v1(10.35,69.21) v1(10.37,68.23) v1(10.37,67.23) v1(10.37,66.23) v1(10.39,65.16) v1(10.39,64.16) v1(10.58,10.58) v1(10.58,9.58) v1(10.58,8.58) v1(11.58,10.58) v1(11.58,9.58) v1(11.58,8.58) v1(12.04,55.28) v1(12.04,54.28) v1(12.04,53.28) v1(12.02,52.31) v1(12.02,51.31) v1(12.02,50.31) v1(12.58,10.58) v1(12.58,9.58) v1(12.58,8.58) v1(13.04,55.28) v1(13.04,54.28) v1(13.04,53.28) v1(13.02,52.31) v1(13.02,51.31) v1(13.02,50.31) v1(14.04,55.28) v1(14.04,54.28) v1(14.04,53.28) v1(14.02,52.31) v1(14.02,51.31) v1(14.02,50.31) v1(16.82,10.76) v1(20.2,51.98) v1(20.2,50.98) v1(20.2,49.98) v1(20.47,17.06) v1(20.47,16.06) v1(20.94,69.62) v1(20.94,68.62) v1(20.94,67.62) v1(21.2,51.98) v1(21.2,50.98) v1(21.2,49.98) v1(21.47,17.06) v1(21.47,16.06) v1(21.58,3.41) v1(21.58,2.41) v1(21.58,1.41) v1(21.65,9.58) v1(21.65,8.58) v1(21.65,7.58) v1(21.65,6.38) v1(21.65,5.38) v1(21.65,4.38) v1(21.94,69.62) v1(21.94,68.62) v1(21.94,67.62) v1(22.18,23.91) v1(22.2,51.98) v1(22.2,50.98) v1(22.2,49.98) v1(22.47,17.06) v1(22.47,16.06) v1(22.58,3.41) v1(22.58,2.41) v1(22.58,1.41) v1(22.65,9.58) v1(22.65,8.58) v1(22.65,7.58) v1(22.65,6.38) v1(22.65,5.38) v1(22.65,4.38) v1(22.94,69.62) v1(22.94,68.62) v1(22.94,67.62) v1(23.58,3.41) v1(23.58,2.41) v1(23.58,1.41) v1(23.65,9.58) v1(23.65,8.58) v1(23.65,7.58) v1(23.65,6.38) v1(23.65,5.38) v1(23.65,4.38) v1(26.83,52.12) v1(26.83,51.12) v1(26.83,50.12) v1(27.29,33.02) v1(27.29,32.02) v1(27.83,52.12) v1(27.83,51.12) v1(27.83,50.12) v1(28.09,74.11) v1(28.09,73.11) v1(28.09,72.11) v1(28.29,33.02) v1(28.83,52.12) v1(28.83,51.12) v1(28.83,50.12) v1(29.09,74.11) v1(29.09,73.11) v1(29.09,72.11) v1(29.29,33.02) v1(29.74,52.12) v1(29.74,51.12) v1(29.74,50.12) v1(30.09,74.11) v1(30.09,73.11) v1(30.09,72.11) v1(30.13,33) v1(30.13,32) v1(30.74,52.12) v1(30.74,51.12) v1(30.74,50.12) v1(30.88,59.08) v1(31.12,74.09) v1(31.12,73.09) v1(31.12,72.09) v1(31.13,33) v1(31.13,32) v1(31.45,37.34) v1(31.45,36.34) v1(31.74,52.12) v1(31.74,51.12) v1(31.74,50.12) v1(31.88,59.08) v1(32.12,74.09) v1(32.12,73.09) v1(32.12,72.09) v1(32.88,59.08) v1(33.12,74.09) v1(33.12,73.09) v1(33.12,72.09) v1(33.98,59.02) v1(34.24,74.1) v1(34.24,73.1) v1(34.24,72.1) v1(34.41,16.86) v1(34.41,15.86) v1(34.98,59.02) v1(35.14,3.06) v1(35.14,2.06) v1(35.14,1.06) v1(35.24,74.1) v1(35.24,73.1) v1(35.24,72.1) v1(35.19,6.15) v1(35.19,5.15) v1(35.19,4.15) v1(35.3,9.59) v1(35.3,8.59) v1(35.3,7.59) v1(35.41,16.86) v1(35.41,15.86) v1(35.98,59.02) v1(36.14,3.06) v1(36.14,2.06) v1(36.14,1.06) v1(36.24,74.1) v1(36.24,73.1) v1(36.24,72.1) v1(36.19,6.15) v1(36.19,5.15) v1(36.19,4.15) v1(36.3,9.59) v1(36.3,8.59) v1(36.3,7.59) v1(36.41,16.86) v1(36.41,15.86) v1(36.93,59.02) v1(37.14,3.06) v1(37.14,2.06) v1(37.14,1.06) v1(37.27,74.06) v1(37.27,73.06) v1(37.27,72.06) v1(37.19,6.15) v1(37.19,5.15) v1(37.19,4.15) v1(37.3,9.59) v1(37.3,8.59) v1(37.3,7.59) v1(37.93,59.02) v1(38.03,70.64) v1(38.03,69.64) v1(38.03,68.64) v1(38.27,74.06) v1(38.27,73.06) v1(38.27,72.06) v1(38.93,59.02) v1(39.03,70.64) v1(39.03,69.64) v1(39.03,68.64) v1(39.27,74.06) v1(39.27,73.06) v1(39.27,72.06) v1(40.03,70.64) v1(40.03,69.64) v1(40.03,68.64) v1(40.3,74.11) v1(40.3,73.11) v1(40.3,72.11) v1(40.58,47.97) v1(40.58,46.97) v1(40.58,45.97) v1(40.58,45.13) v1(40.58,44.13) v1(40.58,43.13) v1(40.58,42.18) v1(40.58,41.18) v1(40.58,40.18) v1(41.3,74.11) v1(41.3,73.11) v1(41.3,72.11) v1(41.58,47.97) v1(41.58,46.97) v1(41.58,45.97) v1(41.58,45.13) v1(41.58,44.13) v1(41.58,43.13) v1(41.58,42.18) v1(41.58,41.18) v1(41.58,40.18) v1(42.3,74.11) v1(42.3,73.11) v1(42.3,72.11) v1(42.58,47.97) v1(42.58,46.97) v1(42.58,45.97) v1(42.58,45.13) v1(42.58,44.13) v1(42.58,43.13) v1(42.58,42.18) v1(42.58,41.18) v1(42.58,40.18) v1(43.44,74.22) v1(43.44,73.22) v1(43.44,72.22) v1(43.75,52.57) v1(43.75,51.57) v1(44.44,74.22) v1(44.44,73.22) v1(44.44,72.22) v1(44.75,52.57) v1(44.75,51.57) v1(45.44,74.22) v1(45.44,73.22) v1(45.44,72.22) v1(45.75,52.57) v1(45.75,51.57) v1(47.81,57.02) v1(48.34,14.59) v1(48.34,13.59) v1(48.34,12.59) v1(48.33,11.43) v1(48.33,10.43) v1(48.33,9.43) v1(48.69,57.02) v1(49.34,14.59) v1(49.34,13.59) v1(49.34,12.59) v1(49.33,11.43) v1(49.33,10.43) v1(49.33,9.43) v1(50.34,14.59) v1(50.34,13.59) v1(50.34,12.59) v1(50.33,11.43) v1(50.33,10.43) v1(50.33,9.43) v1(52.06,24.03) v1(53.13,24.03) v1(54.25,24.03) v1(55.23,24.03) v1(56.54,24.03) v1(56.94,69.88) v1(56.94,68.88) v1(56.94,67.88) v1(57.18,44.51) v1(57.18,43.51) v1(57.18,42.51) v1(57.94,69.88) v1(57.94,68.88) v1(57.94,67.88) v1(58.18,44.51) v1(58.18,43.51) v1(58.18,42.51) v1(58.56,32.27) v1(58.56,31.27) v1(58.87,59.74) v1(58.94,69.88) v1(58.94,68.88) v1(58.94,67.88) v1(58.94,64.84) v1(58.94,63.84) v1(58.94,62.84) v1(59.05,58.54) v1(59.05,57.54) v1(59.05,56.54) v1(59.18,44.51) v1(59.18,43.51) v1(59.18,42.51) v1(59.56,32.27) v1(59.56,31.27) v1(59.87,61.74) v1(59.87,60.74) v1(59.87,59.74) v1(59.94,64.84) v1(59.94,63.84) v1(59.94,62.84) v1(60.05,58.54) v1(60.05,57.54) v1(60.05,56.54) v1(60.56,32.27) v1(60.56,31.27) v1(60.87,61.74) v1(60.87,60.74) v1(60.87,59.74) v1(60.94,64.84) v1(60.94,63.84) v1(60.94,62.84) v1(60.98,54.18) v1(60.98,53.18) v1(60.98,52.18) v1(61.05,58.54) v1(61.05,57.54) v1(61.05,56.54) v1(61.86,35.6) v1(61.86,34.6) v1(61.86,33.6) v1(61.86,32.8) v1(61.86,31.8) v1(61.86,30.8) v1(61.95,66.87) v1(61.95,65.87) v1(61.95,64.87) v1(61.96,63.62) v1(61.96,62.62) v1(61.96,61.62) v1(61.96,60.54) v1(61.96,59.54) v1(61.96,58.54) v1(61.95,57.51) v1(61.95,56.51) v1(61.95,55.51) v1(61.98,54.18) v1(61.98,53.18) v1(61.98,52.18) v1(62.02,73.45) v1(62.02,72.45) v1(62.02,71.45) v1(61.99,70.07) v1(61.99,69.07) v1(61.99,68.07) v1(62.53,12) v1(62.53,11) v1(62.53,10) v1(62.57,9.17) v1(62.57,8.17) v1(62.57,7.17) v1(62.61,6.1) v1(62.61,5.1) v1(62.61,4.1) v1(62.63,3.07) v1(62.63,2.07) v1(62.63,1.07) v1(62.86,35.6) v1(62.86,34.6) v1(62.86,33.6) v1(62.86,32.8) v1(62.86,31.8) v1(62.86,30.8) v1(62.95,66.87) v1(62.95,65.87) v1(62.95,64.87) v1(62.96,63.62) v1(62.96,62.62) v1(62.96,61.62) v1(62.96,60.54) v1(62.96,59.54) v1(62.96,58.54) v1(63.02,73.45) v1(63.02,72.45) v1(63.02,71.45) v1(62.99,70.07) v1(62.99,69.07) v1(62.99,68.07) v1(63.53,12) v1(63.53,11) v1(63.53,10) v1(63.57,9.17) v1(63.57,8.17) v1(63.57,7.17) v1(63.61,6.1) v1(63.61,5.1) v1(63.61,4.1) v1(63.63,3.07) v1(63.63,2.07) v1(63.63,1.07) v1(63.86,35.6) v1(63.86,34.6) v1(63.86,33.6) v1(63.86,32.8) v1(63.86,31.8) v1(63.86,30.8) v1(63.95,66.87) v1(63.95,65.87) v1(63.95,64.87) v1(63.96,63.62) v1(63.96,62.62) v1(63.96,61.62) v1(63.96,60.54) v1(63.96,59.54) v1(63.96,58.54) v1(64.02,73.45) v1(64.02,72.45) v1(64.02,71.45) v1(63.99,70.07) v1(63.99,69.07) v1(63.99,68.07) v1(64.53,12) v1(64.53,11) v1(64.53,10) v1(64.57,9.17) v1(64.57,8.17) v1(64.57,7.17) v1(64.61,6.1) v1(64.61,5.1) v1(64.61,4.1) v1(64.63,3.07) v1(64.63,2.07) v1(64.63,1.07) v1(65.08,60.54) v1(65.08,59.54) v1(65.08,58.54) v1(65.1,66.87) v1(65.1,65.87) v1(65.1,64.87) v1(65.09,63.61) v1(65.09,62.61) v1(65.09,61.61) v1(65.62,10.18) v1(65.62,9.18) v1(65.62,8.18) v1(66.08,60.54) v1(66.08,59.54) v1(66.08,58.54) v1(66.1,66.87) v1(66.1,65.87) v1(66.1,64.87) v1(66.09,63.61) v1(66.09,62.61) v1(66.09,61.61) v1(66.62,10.18) v1(66.62,9.18) v1(66.62,8.18) v1(67.08,60.54) v1(67.08,59.54) v1(67.08,58.54) v1(67.1,66.87) v1(67.1,65.87) v1(67.1,64.87) v1(67.09,63.61) v1(67.09,62.61) v1(67.09,61.61) v1(67.62,10.18) v1(67.62,9.18) v1(67.62,8.18) v1(68.16,66.89) v1(68.16,65.89) v1(68.16,64.89) v1(68.17,63.55) v1(68.17,62.55) v1(68.17,61.55) v1(68.17,60.56) v1(68.17,59.56) v1(68.17,58.56) v1(68.56,46.42) v1(68.56,45.42) v1(68.61,10.18) v1(68.61,9.18) v1(68.61,8.18) v1(69.16,66.89) v1(69.16,65.89) v1(69.16,64.89) v1(69.17,63.55) v1(69.17,62.55) v1(69.17,61.55) v1(69.17,60.56) v1(69.17,59.56) v1(69.17,58.56) v1(69.56,46.42) v1(69.56,45.42) v1(69.61,10.18) v1(69.61,9.18) v1(69.61,8.18) v1(70.16,66.89) v1(70.16,65.89) v1(70.16,64.89) v1(70.17,63.55) v1(70.17,62.55) v1(70.17,61.55) v1(70.17,60.56) v1(70.17,59.56) v1(70.17,58.56) v1(70.56,46.42) v1(70.56,45.42) v1(70.61,10.18) v1(70.61,9.18) v1(70.61,8.18)
VCC: length 6.2
  Top Layer w1.27: C47.1 15.14,57.47 arc(14,57.95) 13.53,59.08 D2.1
  vias: v1(20.39,58.2) v1(20.39,57.2) v1(20.39,56.2) v1(21.39,58.2) v1(21.39,57.2) v1(21.39,56.2) v1(22.39,58.2) v1(22.39,57.2) v1(22.39,56.2) v1(26.97,58.45) v1(26.97,57.45) v1(26.97,56.45) v1(27.97,58.45) v1(27.97,57.45) v1(27.97,56.45) v1(28.97,58.45) v1(28.97,57.45) v1(28.97,56.45) v1(34.11,51.03) v1(34.11,50.03) v1(34.11,49.03) v1(35.11,51.03) v1(35.11,50.03) v1(35.11,49.03) v1(36.11,51.03) v1(36.11,50.03) v1(37.14,50.96) v1(37.14,49.96) v1(38.14,50.96) v1(38.14,49.96) v1(39.14,50.96) v1(39.14,49.96) v1(40.19,54.93) v1(40.19,53.93) v1(40.19,52.93) v1(40.24,51.9) v1(40.24,50.9) v1(40.24,49.9) v1(40.39,56.97) v1(40.39,55.97) v1(41.19,54.93) v1(41.19,53.93) v1(41.19,52.93) v1(41.24,51.9) v1(41.24,50.9) v1(41.24,49.9) v1(41.39,56.97) v1(41.39,55.97) v1(51.06,64.69) v1(51.06,63.69) v1(51.06,62.69) v1(52.06,64.69) v1(52.06,63.69) v1(52.06,62.69) v1(53.06,64.69) v1(53.06,63.69) v1(53.06,62.69)
VIN:
  vias: v1(21.34,72.98) v1(21.34,71.98) v1(21.34,70.98) v1(22.34,72.98) v1(22.34,71.98) v1(22.34,70.98) v1(23.34,72.98) v1(23.34,71.98) v1(23.34,70.98) v1(33.31,69.83) v1(33.31,68.83) v1(33.31,67.83) v1(34.29,66.62) v1(34.29,65.62) v1(34.29,64.62) v1(34.29,63.33) v1(34.29,62.33) v1(34.29,61.33) v1(34.31,69.83) v1(34.31,68.83) v1(34.31,67.83) v1(35.29,66.62) v1(35.29,65.62) v1(35.29,64.62) v1(35.29,63.33) v1(35.29,62.33) v1(35.29,61.33) v1(35.31,69.83) v1(35.31,68.83) v1(35.31,67.83) v1(36.29,66.62) v1(36.29,65.62) v1(36.29,64.62) v1(36.29,63.33) v1(36.29,62.33) v1(36.29,61.33)
(no net):
  vias: v1(39.73,83.74) v1(39.73,82.74) v1(39.73,81.74) v1(40.73,83.74) v1(40.73,82.74) v1(40.73,81.74) v1(41.73,83.74) v1(41.73,82.74) v1(41.73,81.74)
OUT1+: length 6
  Top Layer w0.762: C21.2 C20.2 C23.2
OUT1-: length 8.7
  Top Layer w0.762: C36.2 10.05,15.92 arc(10.02,15.84) C37.2 C38.2 ; C34.2 20.96,12.51 arc(20.98,12.5) R6.2
OUT2+: length 6.1
  Top Layer w0.762: C28.2 C27.2 52.3,19.54 arc(52.3,19.55) C30.2
OUT2-: length 8.6
  Top Layer w0.762: C44.2 C43.2 C46.2 ; R8.2 C42.2
$1N1675: length 5.5
  Top Layer w0.762: R3.2 58.98,49.6 arc(58.98,49.59) R2.1 56.61,49.58 arc(56.3,49.45) 56.17,49.14
$1N1679: length 2.4
  Top Layer w0.762: R5.2 26.21,38.88 arc(26.21,38.88) U2.4
$1N1681:
  vias: v1(21.08,66.14) v1(21.08,65.14) v1(21.08,64.14) v1(22.08,66.14) v1(22.08,65.14) v1(22.08,64.14) v1(23.08,66.14) v1(23.08,65.14) v1(23.08,64.14)
$1N1682: length 2.8
  Top Layer w0.762: R1.1 46.03,54.66 arc(46.04,54.65) LED1.2
$1N4208: length 7.5
  Top Layer w0.381: v1(49.59,25.39) 49.59,26.61 arc(49.59,26.61) C19.2 ; 45.65,22.75 v1(45.65,23.81)
  Inner1 w0.381: v1(45.65,23.81) 48.95,23.81 arc(49.4,24) 49.59,24.45 v1(49.59,25.39)
$1N9903: length 7.6
  Top Layer w0.381: 59.38,22.75 v1(59.38,23.81) ; v1(63.37,25.47) 63.37,26.61 arc(63.37,26.61) C26.2
  Inner1 w0.381: v1(63.37,25.47) 63.37,24.37 arc(63.2,23.98) 62.81,23.81 v1(59.38,23.81)
$1N13903: length 6.2
  Top Layer w0.381: v1(20.37,25.56) 20.37,26.61 arc(20.36,26.61) C33.2 ; 17.81,22.75 v1(17.81,23.81)
  Inner1 w0.381: v1(17.81,23.81) 19.92,23.81 arc(20.23,23.95) 20.37,24.26 v1(20.37,25.56)
$1N21641: length 5
  Top Layer w0.762: R7.2 20.97,14.47 arc(20.98,14.48) R6.1
$1N23696: length 7.7
  Top Layer w0.381: v1(35.97,25.56) 35.97,26.61 arc(35.97,26.61) C41.2 ; 31.92,22.75 v1(31.92,23.81)
  Inner1 w0.381: v1(31.92,23.81) 35.55,23.81 arc(35.84,23.94) 35.97,24.23 v1(35.97,25.56)
$1N23700: length 5
  Top Layer w0.762: R8.1 C42.1 R9.2
$1N29330: length 50.3
  Top Layer w0.305: v1(46.96,25.22) 46.96,22.76 46.95,22.75
  Inner2 w0.305: v1(46.96,25.22) 46.96,30.08 arc(46.68,30.76) 46,31.04 4.52,31.04 arc(4.51,31.05) P1.2
$1N29599: length 47.8
  Top Layer w0.305: 47.6,22.75 v1(47.6,24.41)
  Inner2 w0.305: v1(47.6,24.41) 25.89,24.41 arc(25.03,24.77) 24.67,25.63 24.67,27.2 arc(24.26,28.18) 23.29,28.58 4.58,28.58 arc(4.53,28.56) P1.4
$1N29869: length 50.2
  Top Layer w0.305: U1.10 49.92,21.58 arc(49.93,21.57) v1(49.94,21.56)
  Inner2 w0.305: v1(49.94,21.56) 14.4,21.56 arc(13.68,21.86) 13.38,22.58 13.38,24.92 arc(13.06,25.69) 12.29,26.01 4.55,26.01 arc(4.52,26) P1.6
$1N30141: length 49.4
  Top Layer w0.305: U1.9 v1(50.5,20.93)
  Inner2 w0.305: v1(50.5,20.93) 13.85,20.93 arc(12.9,21.32) 12.51,22.27 12.51,22.72 arc(12.3,23.23) 11.79,23.44 4.52,23.44 arc(4.51,23.44) P1.8
$1N30413: length 47
  Top Layer w0.305: U1.8 49.94,20.28 arc(49.95,20.28) v1(49.95,20.27)
  Inner2 w0.305: v1(49.95,20.27) 5.13,20.27 arc(4.69,20.46) 4.51,20.89
$1N30680: length 46.4
  Top Layer w0.305: U1.6 v1(49.66,18.98)
  Inner2 w0.305: v1(49.66,18.98) 5.13,18.98 arc(4.69,18.8) P1.12
$1N30951: length 47.1
  Top Layer w0.381: U1.5 47.6,16.32 arc(47.6,16.32) v1(47.61,16.31)
  Inner2 w0.305: v1(47.61,16.31) 47.61,17.28 arc(47.46,17.63) 47.12,17.77 9.31,17.77 arc(8.7,17.52) 8.45,16.91 8.45,16.74 arc(8.17,16.08) 7.51,15.8 4.52,15.8 arc(4.51,15.81) 4.51,15.81
$1N32555: length 15.5
  Top Layer w0.381: 60.68,22.75 60.68,23.76 arc(60.83,24.13) 61.2,24.28 64.35,24.28 arc(64.75,24.45) 64.92,24.85 64.92,30.33 arc(65.13,30.85) 65.65,31.06 68.63,31.06 arc(68.64,31.06) P2.16
$1N32824: length 12.5
  Top Layer w0.381: 61.33,22.75 65.05,22.75 arc(65.44,22.91) 65.6,23.29 65.6,27.69 arc(65.83,28.27) 66.41,28.5 68.63,28.5 arc(68.64,28.51) P2.14
$1N33094: length 10.1
  Top Layer w0.381: U5.10 65.61,21.58 arc(66.03,21.75) 66.2,22.16 66.2,25.44 arc(66.35,25.83) 66.74,25.98 68.63,25.98 arc(68.64,25.98) P2.12
$1N33366: length 8
  Top Layer w0.381: 68.64,23.43 67.53,23.43 arc(67.04,23.23) 66.84,22.74 66.84,21.7 arc(66.61,21.16) 66.06,20.93 U5.9
$1N33638: length 6.5
  Top Layer w0.381: U5.8 68.03,20.28 arc(68.46,20.46) 68.64,20.89
$1N33905: length 6.5
  Top Layer w0.381: U5.6 68.02,18.98 arc(68.46,18.8) P2.6
$1N34176: length 9.1
  Top Layer w0.381: 61.33,17.81 61.33,16.35 arc(61.48,15.98) 61.86,15.82 68.63,15.82 arc(68.64,15.82) 68.64,15.81
$1N34444: length 12.2
  Top Layer w0.381: U5.4 60.68,13.91 arc(60.86,13.47) 61.3,13.29 68.62,13.29 arc(68.64,13.29) P2.2
$1N39386: length 46.6
  Top Layer w0.381: U1.4 v1(46.95,16.67)
  Inner2 w0.305: v1(46.95,16.67) 46.95,14.03 arc(46.73,13.52) 46.22,13.3 4.54,13.3 arc(4.52,13.3) P1.16
$1N51388: length 2.2
  Top Layer w0.762: LED2.2 38.94,34.6 arc(38.94,34.59) R10.1
$1N51483: length 2.2
  Top Layer w0.762: 35.24,35.03 35.24,37.25 arc(35.24,37.25) R11.1

## Copper pours and planes (outline as drawn; the poured copper is in the pictures)
+16V on Top Layer: 38.05,38.29 60.67,38.29 60.67,24.99 38.05,24.99
+16V on Top Layer: 38.05,53.23 72.25,53.23 72.25,21.38 38.05,21.38
+16V on Top Layer: 45.24,39.49 55.54,39.49 55.54,36.94 45.24,36.94
-16V on Top Layer: 28.17,27.94 33.88,27.94 33.88,21.38 28.17,21.38
-16V on Top Layer: 12.79,28.15 18.69,28.15 18.69,21.34 12.79,21.34
-16V on Top Layer: 0.37,53.33 29.58,53.33 29.58,24.94 0.37,24.94
-16V on Top Layer: 18.48,43.12 24.96,43.12 24.96,35.6 18.48,35.6
-16V on Top Layer: 23.3,40.58 36.19,40.58 36.19,31.94 23.3,31.94
GND on Top Layer: 29.15,38.01 32.44,38.01 32.44,35.45 29.15,35.45
GND on Top Layer: 1.07,74.79 32.5,74.79 32.5,33.08 1.07,33.08
GND on Top Layer: 5.9,20.1 8.55,20.1 8.55,15.1 5.9,15.1
GND on Top Layer: 17.13,14.54 27.78,14.54 27.78,0.89 17.13,0.89
GND on Top Layer: 11.89,31.69 30.7,31.69 30.7,15.69 11.89,15.69
GND on Top Layer: 41.41,31.36 58.25,31.36 58.25,19.4 41.41,19.4
GND on Top Layer: 32.95,25.1 44.44,25.1 44.44,15.63 32.95,15.63
GND on Top Layer: 30.18,59.89 39.68,59.89 39.68,55.81 30.18,55.81
GND on Top Layer: 48.03,48.62 61.9,48.62 61.9,38.88 48.03,38.88
GND on Top Layer: 26.95,74.93 49.12,74.93 49.12,62.6 26.95,62.6
GND on Top Layer: 44.3,15.12 55.58,15.12 55.58,0.83 44.3,0.83
GND on Top Layer: 66.82,47.01 72.13,47.01 72.13,40.48 66.82,40.48
GND on Top Layer: 30.66,14.73 41.57,14.73 41.57,0.72 30.66,0.72
GND on Top Layer: 1.15,47.57 6.48,47.57 6.48,40.63 1.15,40.63
GND on Top Layer: 54.56,74.62 71.8,74.62 71.8,48.86 54.56,48.86
GND on Top Layer: 34.36,53.31 46.8,53.31 46.8,36.95 34.36,36.95
GND on Top Layer: 55.54,36.35 67.37,36.35 67.37,28.15 55.54,28.15
GND on Top Layer: 45.09,57.84 49.16,57.84 49.16,56.19 45.09,56.19
GND on Top Layer: 57.97,32.62 72.45,32.62 72.45,0.65 57.97,0.65
GND on Top Layer: 0.48,34.53 16.62,34.53 16.62,0.85 0.48,0.85
GND on Top Layer: 15.15,13.3 17.14,13.3 17.14,10.46 15.15,10.46
GND on Top Layer: 26.82,33.31 37.1,33.31 37.1,27.84 26.82,27.84
GND on Bottom Layer: -10.09,82.65 88.88,82.65 88.88,-20.24 -10.09,-20.24
GND on Inner1: -6.4,88.93 90.07,88.93 90.07,-3.61 -6.4,-3.61
GND on Inner2: -10.69,97.5 85.78,97.5 85.78,-2.89 -10.69,-2.89
VCC on Top Layer: 30.67,46.8 36.39,46.8 36.39,41.06 30.67,41.06
VCC on Top Layer: 16.63,73.78 55.58,73.78 55.58,41.06 16.63,41.06
VCC on Top Layer: 11.49,62.17 20.76,62.17 20.76,59.5 11.49,59.5
VIN on Top Layer: 15.94,74.15 47.68,74.15 47.68,60.36 15.94,60.36
OUT1+ on Top Layer: 38.03,16.55 44.48,16.55 44.48,2.29 38.03,2.29
OUT1+ on Top Layer: 37.59,20.06 46.52,20.06 46.52,15.64 37.59,15.64
OUT1- on Top Layer: 9.13,20.08 17.41,20.08 17.41,17.18 9.13,17.18
OUT1- on Top Layer: 10.94,16.57 19.38,16.57 19.38,0.3 10.94,0.3
OUT2+ on Top Layer: 51.31,20.06 60.24,20.06 60.24,15.64 51.31,15.64
OUT2+ on Top Layer: 51.58,16.71 57.85,16.71 57.85,2.16 51.58,2.16
OUT2- on Top Layer: 24.48,16.57 31.04,16.57 31.04,1.03 24.48,1.03
OUT2- on Top Layer: 23.75,20.09 31.48,20.09 31.48,17.19 23.75,17.19
$1N1673 on Top Layer: 48.98,51.24 52.69,51.24 52.69,48.09 48.98,48.09
$1N1674 on Top Layer: 43.89,55.74 52.69,55.74 52.69,42.89 43.89,42.89
$1N1677 on Top Layer: 25.21,46.17 28.77,46.17 28.77,42.36 25.21,42.36
$1N1678 on Top Layer: 18.1,47.82 32.83,47.82 32.83,42.36 18.1,42.36
$1N1679 on Top Layer: 25.46,37.53 28.89,37.53 28.89,35.6 25.46,35.6
$1N1681 on Top Layer: 17.34,66.61 32.83,66.61 32.83,61.64 17.34,61.64
$1N21641 on Top Layer: 15.03,18.4 18.69,18.4 18.69,13.76 15.03,13.76
$1N23700 on Top Layer: 29.21,18.41 32.81,18.41 32.81,13.82 29.21,13.82

Small or netless copper shapes (teardrops, artwork), in the pictures only: 99 on Top Layer, 8 on Inner1, 16 on Inner2
